# Altium project 扩展.PrjPCB (part 1 of 2)
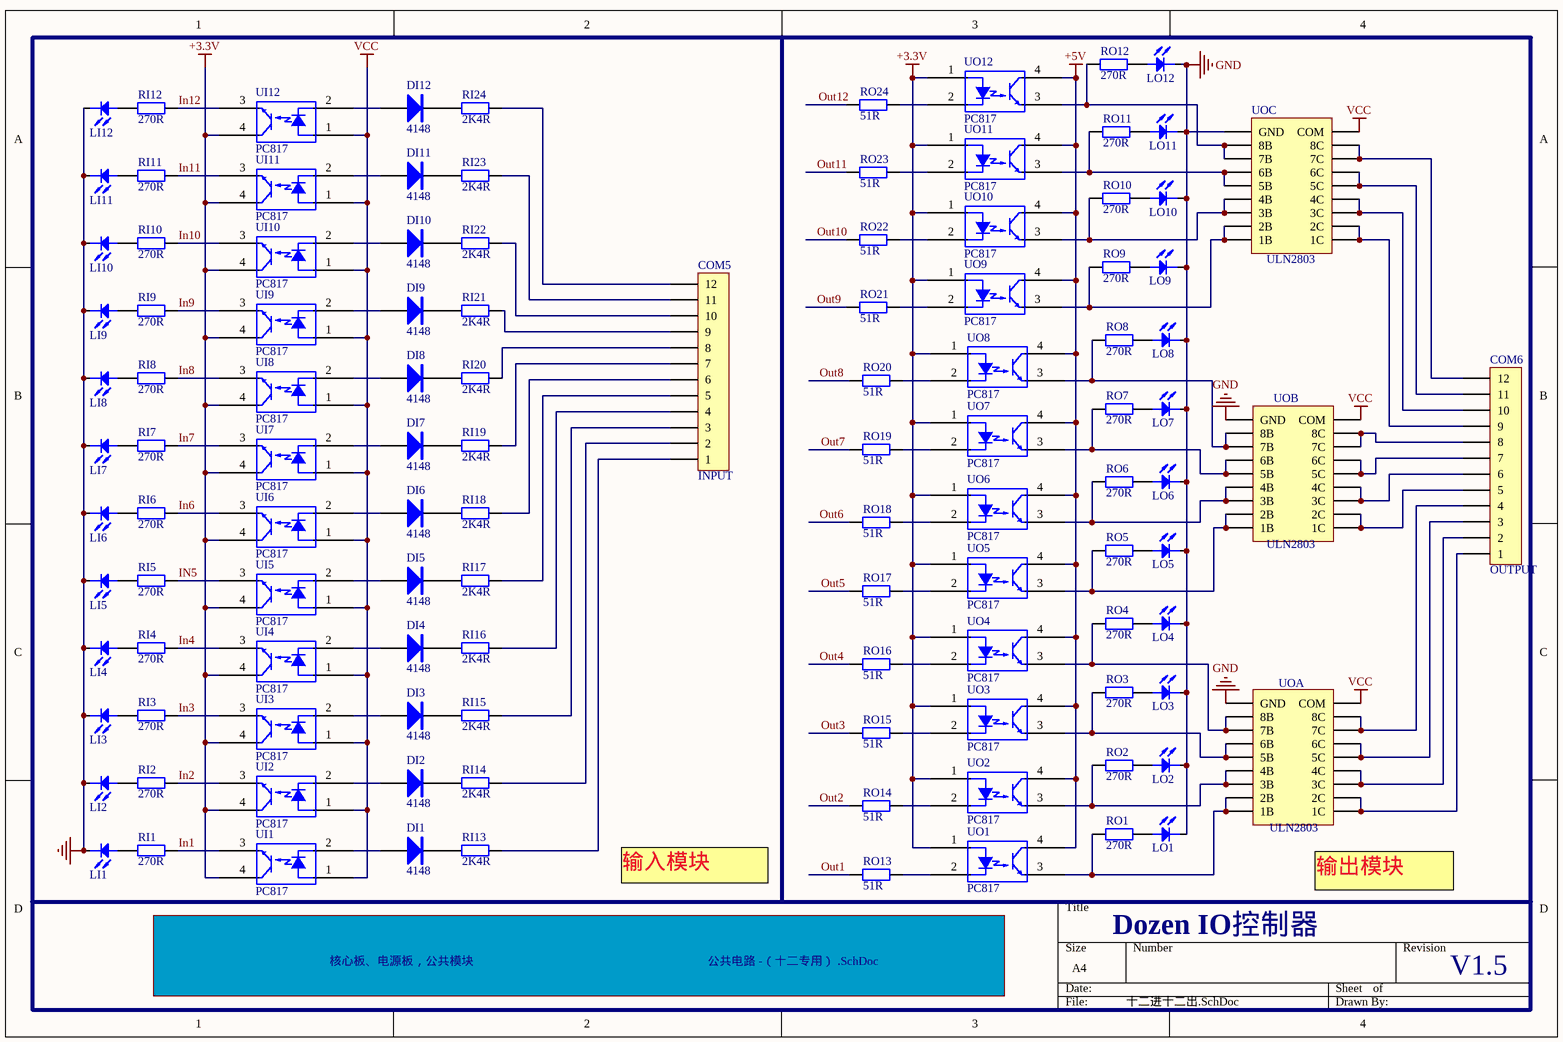
[diagram p0: 十二进十二出.SchDoc]
12 sheets, 1246 parts. Net scope: global (net labels, ports and power ports of the same name join across sheets).
Board files: 十二进十二出 .PcbDoc, 核心板.PcbDoc, 电源板.PcbDoc, 八进八出.PcbDoc, 十六路输入.PcbDoc, 十六路输出.PcbDoc, 十六继电器.PcbDoc, 电机控制.PcbDoc, 模拟量.PcbDoc, 四进四出三电机.PcbDoc, PCB模版.PcbDoc, 底板模版.PcbDoc
Sheets:
  十二进十二出.SchDoc
    核心板、电源板，公共模块 = 公共电路 -（十二专用） .SchDoc
  核心板.SchDoc
  电源板.SchDoc
  八进八出.SchDoc
    核心板、电源板 = 公共电路.SchDoc
  十六路输入.SchDoc
    MCU及电源 = 公共电路.SchDoc
  十六路输出.SchDoc
    MCU及电源 = 公共电路.SchDoc
  十六继电器.SchDoc
    MCU及电源 = 公共电路.SchDoc
  电机控制.SchDoc
     = 公共电路.SchDoc
  模拟量.SchDoc
    MCU及电源 = 公共电路.SchDoc
  四进四出三电机.SchDoc
    MCU及电源 = 公共电路.SchDoc

## Sheet 十二进十二出.SchDoc: Dozen IO控制器
size A4; Revision: V1.5; SheetNumber: 0; SheetTotal: 0; DrawnBy: 小熊

### Parts
COM5  INPUT  [CON12-5.1卧上]
COM6  OUTPUT  [CON12-5.1卧下]
DI1  4148  [1206C]
DI2  4148  [1206C]
DI3  4148  [1206C]
DI4  4148  [1206C]
DI5  4148  [1206C]
DI6  4148  [1206C]
DI7  4148  [1206C]
DI8  4148  [1206C]
DI9  4148  [1206C]
DI10  4148  [1206C]
DI11  4148  [1206C]
DI12  4148  [1206C]
LI1  LED  [SMDLED]  (value not drawn)
LI2  LED  [SMDLED]  (value not drawn)
LI3  LED  [SMDLED]  (value not drawn)
LI4  LED  [SMDLED]  (value not drawn)
LI5  LED  [SMDLED]  (value not drawn)
LI6  LED  [SMDLED]  (value not drawn)
LI7  LED  [SMDLED]  (value not drawn)
LI8  LED  [SMDLED]  (value not drawn)
LI9  LED  [SMDLED]  (value not drawn)
LI10  LED  [SMDLED]  (value not drawn)
LI11  LED  [SMDLED]  (value not drawn)
LI12  LED  [SMDLED]  (value not drawn)
LO1  LED  [SMDLED]  (value not drawn)
LO2  LED  [SMDLED]  (value not drawn)
LO3  LED  [SMDLED]  (value not drawn)
LO4  LED  [SMDLED]  (value not drawn)
LO5  LED  [SMDLED]  (value not drawn)
LO6  LED  [SMDLED]  (value not drawn)
LO7  LED  [SMDLED]  (value not drawn)
LO8  LED  [SMDLED]  (value not drawn)
LO9  LED  [SMDLED]  (value not drawn)
LO10  LED  [SMDLED]  (value not drawn)
LO11  LED  [SMDLED]  (value not drawn)
LO12  LED  [SMDLED]  (value not drawn)
RI1  270R  [0603A]
RI2  270R  [0603A]
RI3  270R  [0603A]
RI4  270R  [0603A]
RI5  270R  [0603A]
RI6  270R  [0603A]
RI7  270R  [0603A]
RI8  270R  [0603A]
RI9  270R  [0603A]
RI10  270R  [0603A]
RI11  270R  [0603A]
RI12  270R  [0603A]
RI13  2K4R  [0603A]
RI14  2K4R  [0603A]
RI15  2K4R  [0603A]
RI16  2K4R  [0603A]
RI17  2K4R  [0603A]
RI18  2K4R  [0603A]
RI19  2K4R  [0603A]
RI20  2K4R  [0603A]
RI21  2K4R  [0603A]
RI22  2K4R  [0603A]
RI23  2K4R  [0603A]
RI24  2K4R  [0603A]
RO1  270R  [0603A]
RO2  270R  [0603A]
RO3  270R  [0603A]
RO4  270R  [0603A]
RO5  270R  [0603A]
RO6  270R  [0603A]
RO7  270R  [0603A]
RO8  270R  [0603A]
RO9  270R  [0603A]
RO10  270R  [0603A]
RO11  270R  [0603A]
RO12  270R  [0603A]
RO13  51R  [0603A]
RO14  51R  [0603A]
RO15  51R  [0603A]
RO16  51R  [0603A]
RO17  51R  [0603A]
RO18  51R  [0603A]
RO19  51R  [0603A]
RO20  51R  [0603A]
RO21  51R  [0603A]
RO22  51R  [0603A]
RO23  51R  [0603A]
RO24  51R  [0603A]
UI1  PC817  [PC817]
UI2  PC817  [PC817]
UI3  PC817  [PC817]
UI4  PC817  [PC817]
UI5  PC817  [PC817]
UI6  PC817  [PC817]
UI7  PC817  [PC817]
UI8  PC817  [PC817]
UI9  PC817  [PC817]
UI10  PC817  [PC817]
UI11  PC817  [PC817]
UI12  PC817  [PC817]
UO1  PC817  [PC817]
UO2  PC817  [PC817]
UO3  PC817  [PC817]
UO4  PC817  [PC817]
UO5  PC817  [PC817]
UO6  PC817  [PC817]
UO7  PC817  [PC817]
UO8  PC817  [PC817]
UO9  PC817  [PC817]
UO10  PC817  [PC817]
UO11  PC817  [PC817]
UO12  PC817  [PC817]
UOA  ULN2803  [sol18]
UOB  ULN2803  [sol18]
UOC  ULN2803  [sol18]

### Sub-sheets
核心板、电源板，公共模块 = 公共电路 -（十二专用） .SchDoc: no entries

### Nets
+3.3V: UI1.4(COL) UI2.4(COL) UI3.4(COL) UI4.4(COL) UI5.4(COL) UI6.4(COL) UI7.4(COL) UI8.4(COL) UI9.4(COL) UI10.4(COL) UI11.4(COL) UI12.4(COL) UO1.1(ANODE) UO2.1(ANODE) UO3.1(ANODE) UO4.1(ANODE) UO5.1(ANODE) UO6.1(ANODE) UO7.1(ANODE) UO8.1(ANODE) UO9.1(ANODE) UO10.1(ANODE) UO11.1(ANODE) UO12.1(ANODE)
+5V: UO1.4(COL) UO2.4(COL) UO3.4(COL) UO4.4(COL) UO5.4(COL) UO6.4(COL) UO7.4(COL) UO8.4(COL) UO9.4(COL) UO10.4(COL) UO11.4(COL) UO12.4(COL)
GND: LI1.K LI2.K LI3.K LI4.K LI5.K LI6.K LI7.K LI8.K LI9.K LI10.K LI11.K LI12.K LO1.K LO2.K LO3.K LO4.K LO5.K LO6.K LO7.K LO8.K LO9.K LO10.K LO11.K LO12.K UOA.9(GND) UOB.9(GND) UOC.9(GND)
VCC: UI1.1(ANODE) UI2.1(ANODE) UI3.1(ANODE) UI4.1(ANODE) UI5.1(ANODE) UI6.1(ANODE) UI7.1(ANODE) UI8.1(ANODE) UI9.1(ANODE) UI10.1(ANODE) UI11.1(ANODE) UI12.1(ANODE) UOA.10(COM) UOB.10(COM) UOC.10(COM)
In1: RI1.1 UI1.3(EMIT)
In2: RI2.1 UI2.3(EMIT)
In3: RI3.1 UI3.3(EMIT)
In4: RI4.1 UI4.3(EMIT)
IN5: RI5.1 UI5.3(EMIT)
In6: RI6.1 UI6.3(EMIT)
In7: RI7.1 UI7.3(EMIT)
In8: RI8.1 UI8.3(EMIT)
In9: RI9.1 UI9.3(EMIT)
In10: RI10.1 UI10.3(EMIT)
In11: RI11.1 UI11.3(EMIT)
In12: RI12.1 UI12.3(EMIT)
Out1: RO13.1
Out2: RO14.1
Out3: RO15.1
Out4: RO16.1
Out5: RO17.1
Out6: RO18.1
Out7: RO19.1
Out8: RO20.1
Out9: RO21.1
Out10: RO22.1
Out11: RO23.1
Out12: RO24.1
NetCOM5_1: COM5.1 RI13.2
NetCOM5_2: COM5.2 RI14.2
NetCOM5_3: COM5.3 RI15.2
NetCOM5_4: COM5.4 RI16.2
NetCOM5_5: COM5.5 RI17.2
NetCOM5_6: COM5.6 RI18.2
NetCOM5_7: COM5.7 RI19.2
NetCOM5_8: COM5.8 RI20.2
NetCOM5_9: COM5.9 RI21.2
NetCOM5_10: COM5.10 RI22.2
NetCOM5_11: COM5.11 RI23.2
NetCOM5_12: COM5.12 RI24.2
NetCOM6_1: COM6.1 UOA.17(2C) UOA.18(1C)
NetCOM6_2: COM6.2 UOA.15(4C) UOA.16(3C)
NetCOM6_3: COM6.3 UOA.13(6C) UOA.14(5C)
NetCOM6_4: COM6.4 UOA.11(8C) UOA.12(7C)
NetCOM6_5: COM6.5 UOB.17(2C) UOB.18(1C)
NetCOM6_6: COM6.6 UOB.15(4C) UOB.16(3C)
NetCOM6_7: COM6.7 UOB.13(6C) UOB.14(5C)
NetCOM6_8: COM6.8 UOB.11(8C) UOB.12(7C)
NetCOM6_9: COM6.9 UOC.17(2C) UOC.18(1C)
NetCOM6_10: COM6.10 UOC.15(4C) UOC.16(3C)
NetCOM6_11: COM6.11 UOC.13(6C) UOC.14(5C)
NetCOM6_12: COM6.12 UOC.11(8C) UOC.12(7C)
NetDI1_A: DI1.A UI1.2(CATH)
NetDI1_K: DI1.K RI13.1
NetDI2_A: DI2.A UI2.2(CATH)
NetDI2_K: DI2.K RI14.1
NetDI3_A: DI3.A UI3.2(CATH)
NetDI3_K: DI3.K RI15.1
NetDI4_A: DI4.A UI4.2(CATH)
NetDI4_K: DI4.K RI16.1
NetDI5_A: DI5.A UI5.2(CATH)
NetDI5_K: DI5.K RI17.1
NetDI6_A: DI6.A UI6.2(CATH)
NetDI6_K: DI6.K RI18.1
NetDI7_A: DI7.A UI7.2(CATH)
NetDI7_K: DI7.K RI19.1
NetDI8_A: DI8.A UI8.2(CATH)
NetDI8_K: DI8.K RI20.1
NetDI9_A: DI9.A UI9.2(CATH)
NetDI9_K: DI9.K RI21.1
NetDI10_A: DI10.A UI10.2(CATH)
NetDI10_K: DI10.K RI22.1
NetDI11_A: DI11.A UI11.2(CATH)
NetDI11_K: DI11.K RI23.1
NetDI12_A: DI12.A UI12.2(CATH)
NetDI12_K: DI12.K RI24.1
NetLI1_A: LI1.A RI1.2
NetLI2_A: LI2.A RI2.2
NetLI3_A: LI3.A RI3.2
NetLI4_A: LI4.A RI4.2
NetLI5_A: LI5.A RI5.2
NetLI6_A: LI6.A RI6.2
NetLI7_A: LI7.A RI7.2
NetLI8_A: LI8.A RI8.2
NetLI9_A: LI9.A RI9.2
NetLI10_A: LI10.A RI10.2
NetLI11_A: LI11.A RI11.2
NetLI12_A: LI12.A RI12.2
NetLO1_A: LO1.A RO1.2
NetLO2_A: LO2.A RO2.2
NetLO3_A: LO3.A RO3.2
NetLO4_A: LO4.A RO4.2
NetLO5_A: LO5.A RO5.2
NetLO6_A: LO6.A RO6.2
NetLO7_A: LO7.A RO7.2
NetLO8_A: LO8.A RO8.2
NetLO9_A: LO9.A RO9.2
NetLO10_A: LO10.A RO10.2
NetLO11_A: LO11.A RO11.2
NetLO12_A: LO12.A RO12.2
NetRO1_1: RO1.1 UO1.3(EMIT) UOA.1(1B) UOA.2(2B)
NetRO2_1: RO2.1 UO2.3(EMIT) UOA.3(3B) UOA.4(4B)
NetRO3_1: RO3.1 UO3.3(EMIT) UOA.5(5B) UOA.6(6B)
NetRO4_1: RO4.1 UO4.3(EMIT) UOA.7(7B) UOA.8(8B)
NetRO5_1: RO5.1 UO5.3(EMIT) UOB.1(1B) UOB.2(2B)
NetRO6_1: RO6.1 UO6.3(EMIT) UOB.3(3B) UOB.4(4B)
NetRO7_1: RO7.1 UO7.3(EMIT) UOB.5(5B) UOB.6(6B)
NetRO8_1: RO8.1 UO8.3(EMIT) UOB.7(7B) UOB.8(8B)
NetRO9_1: RO9.1 UO9.3(EMIT) UOC.1(1B) UOC.2(2B)
NetRO10_1: RO10.1 UO10.3(EMIT) UOC.3(3B) UOC.4(4B)
NetRO11_1: RO11.1 UO11.3(EMIT) UOC.5(5B) UOC.6(6B)
NetRO12_1: RO12.1 UO12.3(EMIT) UOC.7(7B) UOC.8(8B)
NetRO13_2: RO13.2 UO1.2(CATH)
NetRO14_2: RO14.2 UO2.2(CATH)
NetRO15_2: RO15.2 UO3.2(CATH)
NetRO16_2: RO16.2 UO4.2(CATH)
NetRO17_2: RO17.2 UO5.2(CATH)
NetRO18_2: RO18.2 UO6.2(CATH)
NetRO19_2: RO19.2 UO7.2(CATH)
NetRO20_2: RO20.2 UO8.2(CATH)
NetRO21_2: RO21.2 UO9.2(CATH)
NetRO22_2: RO22.2 UO10.2(CATH)
NetRO23_2: RO23.2 UO11.2(CATH)
NetRO24_2: RO24.2 UO12.2(CATH)

### Notes on the sheet
- 输入模块
- (near UOA) 输出模块

### Library data of the parts
COM5 COM6 = CON12
RI1-RI24 RO1-RO24 = Res2: Resistor; Value: 1K; Published: 8-Jun-2000; LatestRevisionDate: 17-Jul-2002; LatestRevisionNote: Re-released for DXP Platform.; PackageReference: AXIAL-0.4; Publisher: Altium Limited
UI1-UI12 UO1-UO12 = TLP521-1: Single NPN PhotoTransistor OptoCoupler.

## Sheet 公共电路 -（十二专用） .SchDoc: Dozen IO控制器
size A4; Revision: V1.5; Time: 2014年3月27日11:29:06
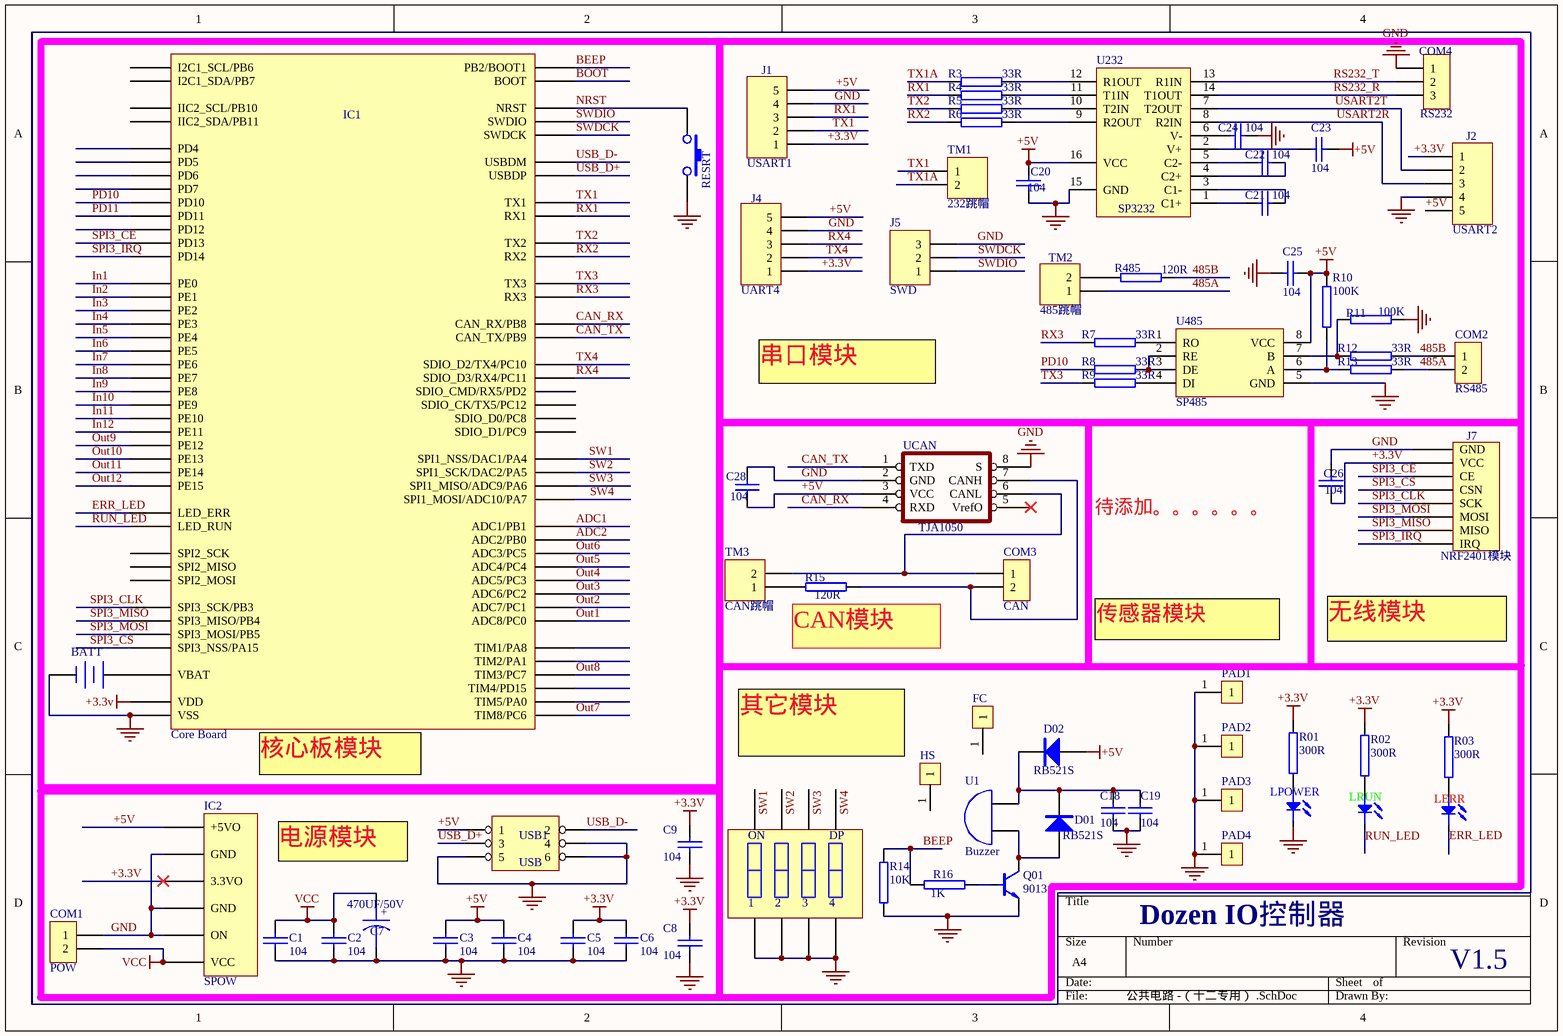
[diagram p1: 公共电路 -（十二专用） .SchDoc]

### Parts
(Parts that share a designator on the sheet are numbered #1, #2 ... from top to bottom, then left to right.)
BATT  电源底座  [MINI-BAT]  (value not drawn)
C1#1  104  [0603A]
C2#1  104  [0603A]
C3#1  104  [0603A]
C4#1  104  [0603A]
C5#1  104  [0603A]
C6#1  104  [0603A]
C7#1  470UF/50V  [电解电容10mm]
C8#1  104  [0603A]
C9  104  [0603A]
C18#1  104  [0603A]
C19  104  [0603A]
C20  104  [0603A]
C21  104  [0603A]
C22  104  [0603A]
C23  104  [0603A]
C24  104  [0603A]
C25  104  [0603A]
C26#1  104  [0603A]
C28  104  [0603A]
COM1  POW  [CON2-5.1卧]
COM2  RS485  [CON2-5.1卧]
COM3  CAN  [CON2-5.1卧]
COM4#1  RS232  [CON3-5.1卧]
D01  RB521S  [贴片二极管]
D02  RB521S  [贴片二极管]
FC  (no value)  [fc]
HS  (no value)  [HS]
IC1  Core Board  [核心板-物联网1]
IC2  SPOW  [电源板]
J1#1  USART1  [2.54排针1*5]
J2#1  USART2  [2.54排针1*5]
J4  UART4  [2.54排针1*5]
J5  SWD  [2.54排针1*3]
J7  NRF2401模块  [NRF24L01]
LERR  ERR  [LED2.5]  (value not drawn)
LPOWER  PLED  [LED2.5]  (value not drawn)
LRUN  RUN  [LED2.5]  (value not drawn)
PAD1  PAD  [PAD]  (value not drawn)
PAD2  PAD  [PAD]  (value not drawn)
PAD3  PAD  [PAD]  (value not drawn)
PAD4  PAD  [PAD]  (value not drawn)
Q01  9013  [SOT23]
R01  300R  [0603A]
R02  300R  [0603A]
R03  300R  [0603A]
R3  33R  [0603A]
R4  33R  [0603A]
R5  33R  [0603A]
R6  33R  [0603A]
R7  33R  [0603A]
R8  33R  [0603A]
R9  33R  [0603A]
R10  100K  [0603A]
R11  100K  [0603A]
R12  33R  [0603A]
R13  33R  [0603A]
R14#1  10K  [0603A]
R15#1  120R  [0603A]
R16#1  1K  [0603A]
R485  120R  [0603A]
S1  拨码开关*4  [SWITCH*4]  (value not drawn)
S2  RESRT  [SW-PB2]
TM1  232跳帽  [2.54排针1*2]
TM2  485跳帽  [2.54排针1*2]
TM3  CAN跳帽  [2.54排针1*2]
U1#1  Buzzer  [蜂鸣器]
U232  SP3232  [TSSOP16]
U485  SP485  [SO8_L]
UCAN  TJA1050  [SO8_L]
USB1  USB  [USB-B3]

### Nets
+3.3V: C5#1.1 C6#1.1 C8#1.1 C9.1 C26#1.2 IC1.2(VDD) IC2.3(3.3VO) J1#1.1 J2#1.1 J4.1 J7.2(VCC) R01.1 R02.1 R03.1
+5V: C3#1.1 C4#1.1 C20.1 C23.2 C25.2 C28.2 D02.A IC2.1(+5VO) J1#1.5 J2#1.5 J4.5 R10.2 U232.16(VCC) U485.8(VCC) UCAN.3(VCC) USB1.1
GND: BATT.2(-) C1#1.2 C2#1.2 C3#1.2 C4#1.2 C5#1.2 C6#1.2 C7#1.2 C8#1.2 C9.2 C18#1.2 C19.2 C20.2 C24.2 C25.1 C26#1.1 C28.1 COM1.1 COM4#1.1 IC1.1(VSS) IC2.2(GND) IC2.4(GND) IC2.5(ON) J1#1.4 J2#1.4 J4.4 J5.3 J7.1(GND) LPOWER.K PAD1.1 PAD2.1 PAD3.1 PAD4.1 Q01.2(e) R11.2 R14#1.1 S1.5 S1.6 S1.7 S1.8 S2.2 U232.15(GND) U485.5(GND) UCAN.2(GND) UCAN.8(S) USB1.4 USB1.5 USB1.6
VCC: C1#1.1 C2#1.1 C7#1.1 COM1.2 IC2.6(VCC)
485A: COM2.2 R13.2 TM2.1
485B: COM2.1 R12.2 R485.2
ADC1: IC1.33(ADC1/PB1)
ADC2: IC1.34(ADC2/PB0)
BEEP: IC1.31(PB2/BOOT1) R14#1.2 R16#1.1
BOOT: IC1.3(BOOT)
CAN_RX: IC1.68(CAN_RX/PB8) UCAN.4(RXD)
CAN_TX: IC1.67(CAN_TX/PB9) UCAN.1(TXD)
ERR_LED: IC1.11(LED_ERR) LERR.K
In1: IC1.58(PE0)
In2: IC1.57(PE1)
In3: IC1.56(PE2)
In4: IC1.55(PE3)
IN5: IC1.54(PE4)
In6: IC1.53(PE5)
In7: IC1.52(PE6)
In8: IC1.51(PE7)
In9: IC1.30(PE8)
In10: IC1.29(PE9)
In11: IC1.28(PE10)
In12: IC1.27(PE11)
NRST: IC1.4(NRST) S2.1
Out1: IC1.49(ADC8/PC0)
Out2: IC1.50(ADC7/PC1)
Out3: IC1.47(ADC6/PC2)
Out4: IC1.48(ADC5/PC3)
Out5: IC1.36(ADC4/PC4)
Out6: IC1.35(ADC3/PC5)
Out7: IC1.41(TIM8/PC6)
Out8: IC1.44(TIM3/PC7)
Out9: IC1.26(PE12)
Out10: IC1.25(PE13)
Out11: IC1.24(PE14)
Out12: IC1.23(PE15)
PD10: IC1.13(PD10) R8.1
PD11: IC1.62(PD11)
RS232_R: COM4#1.3 U232.14(T1OUT)
RS232_T: COM4#1.2 U232.13(R1IN)
RUN_LED: IC1.12(LED_RUN) LRUN.K
RX1: IC1.10(RX1) J1#1.3 R4.1
RX2: IC1.18(RX2) R6.1
RX3: IC1.20(RX3) R7.1
RX4: IC1.80(SDIO_D3/RX4/PC11) J4.3
SPI3_CE: IC1.60(PD13) J7.3(CE)
SPI3_CLK: IC1.73(SPI3_SCK/PB3) J7.5(SCK)
SPI3_CS: IC1.74(SPI3_NSS/PA15) J7.4(CSN)
SPI3_IRQ: IC1.59(PD14) J7.8(IRQ)
SPI3_MISO: IC1.72(SPI3_MISO/PB4) J7.7(MISO)
SPI3_MOSI: IC1.71(SPI3_MOSI/PB5) J7.6(MOSI)
SW1: IC1.39(SPI1_NSS/DAC1/PA4) S1.1
SW2: IC1.40(SPI1_SCK/DAC2/PA5) S1.2
SW3: IC1.37(SPI1_MISO/ADC9/PA6) S1.3
SW4: IC1.38(SPI1_MOSI/ADC10/PA7) S1.4
SWDCK: IC1.6(SWDCK) J5.2
SWDIO: IC1.5(SWDIO) J5.1
TX1: IC1.9(TX1) J1#1.2 TM1.1
TX1A: R3.1 TM1.2
TX2: IC1.17(TX2) R5.1
TX3: IC1.19(TX3) R9.1
TX4: IC1.79(SDIO_D2/TX4/PC10) J4.2
USART2R: J2#1.3 U232.8(R2IN)
USART2T: J2#1.2 U232.7(T2OUT)
USB_D+: IC1.8(USBDP) USB1.3
USB_D-: IC1.7(USBDM) USB1.2
NetBATT_1: BATT.1(+) IC1.32(VBAT)
NetC18#1_1: C18#1.1 C19.1 D01.K D02.K U1#1.1(A)
NetC21_1: C21.1 U232.1(C1+)
NetC21_2: C21.2 U232.3(C1-)
NetC22_1: C22.1 U232.5(C2-)
NetC22_2: C22.2 U232.4(C2+)
NetC23_1: C23.1 U232.2(V+)
NetC24_1: C24.1 U232.6(V-)
NetCOM3_1: COM3.1 TM3.2 UCAN.6(CANL)
NetCOM3_2: COM3.2 R15#1.2 UCAN.7(CANH)
NetD01_A: D01.A Q01.3(c) U1#1.2(B)
NetLERR_A: LERR.A R03.2
NetLPOWER_A: LPOWER.A R01.2
NetLRUN_A: LRUN.A R02.2
NetQ01_1: Q01.1(b) R16#1.2
NetR3_2: R3.2 U232.12(R1OUT)
NetR4_2: R4.2 U232.11(T1IN)
NetR5_2: R5.2 U232.10(T2IN)
NetR6_2: R6.2 U232.9(R2OUT)
NetR7_2: R7.2 U485.1(RO)
NetR8_2: R8.2 U485.2(RE) U485.3(DE)
NetR9_2: R9.2 U485.4(DI)
NetR10_1: R10.1 R13.1 U485.6(A)
NetR11_1: R11.1 R12.1 U485.7(B)
NetR15#1_1: R15#1.1 TM3.1
NetR485_1: R485.1 TM2.2

Not connected (* = marked no-connect by the designer): FC 1; HS 1; IC1 14(SPI2_SCK) 15(SPI2_MISO) 16(SPI2_MOSI) 21(IIC2_SDA/PB11) 22(IIC2_SCL/PB10) 42(TIM4/PD15) 43(TIM1/PA8) 45(TIM5/PA0) 46(TIM2/PA1) 61(PD12) 63(PD4) 64(PD5) 65(PD6) 66(PD7) 69(I2C1_SDA/PB7) 70(I2C1_SCL/PB6) 75(SDIO_D1/PC9) 76(SDIO_D0/PC8) 77(SDIO_CMD/RX5/PD2) 78(SDIO_CK/TX5/PC12); UCAN 5(VrefO)*

### Notes on the sheet
- 串口模块
- (near C26#1) 待添加。。。。。。
- (near R15#1) CAN模块
- (near PAD1) 传感器模块
- (near J7) 无线模块
- (near IC1) 核心板模块
- (near HS) 其它模块
- 电源模块
- (in symbol CAPACITOR POL) +
- (in symbol 拨码开关*4) ON; DP

### Library data of the parts
BATT = Battery: XH414H; Published: 24-Mar-1999; LatestRevisionDate: 17-Jul-2002; LatestRevisionNote: Re-released for DXP Platform.; PackageReference: BAT-2; Publisher: Altium Limited; PackageDescription: Battery; 2 Leads
C1#1 C2#1 C3#1 C4#1 C5#1 C6#1 C8#1 C9 C18#1 C19-C25 C26#1 C28 = CAP: Capacitor
C7#1 = CAPACITOR POL: Capacitor
COM1-COM3 = CON2
COM4#1 = CON3
FC HS = PAD
IC1 = 物联网核心板
J1#1 J2#1 J4 = Header 5: Header, 4-Pin; LatestRevisionDate: 17-Jul-2002; LatestRevisionNote: Re-released for DXP Platform.; Publisher: Altium Limited
J5 = Header 3: Header, 4-Pin; LatestRevisionDate: 17-Jul-2002; LatestRevisionNote: Re-released for DXP Platform.; Publisher: Altium Limited
LERR LPOWER LRUN = LED
Q01 = NPN
R01 R02 R03 R3-R13 R14#1 R15#1 R16#1 R485 = RES2
S2 = SW-PB
TM1-TM3 = Header 2: Header, 2-Pin; LatestRevisionDate: 17-Jul-2002; LatestRevisionNote: Re-released for DXP Platform.; Publisher: Altium Limited
U232 = SP3232EEA
USB1 = HEADER 3X2

## Sheet 核心板.SchDoc: 阿波罗简易型控制器核心板
size A3; CompanyName: 东莞市月无声电子设备有限公司; Revision: V1.2; DocumentName: 阿波罗简易型控制器核心板
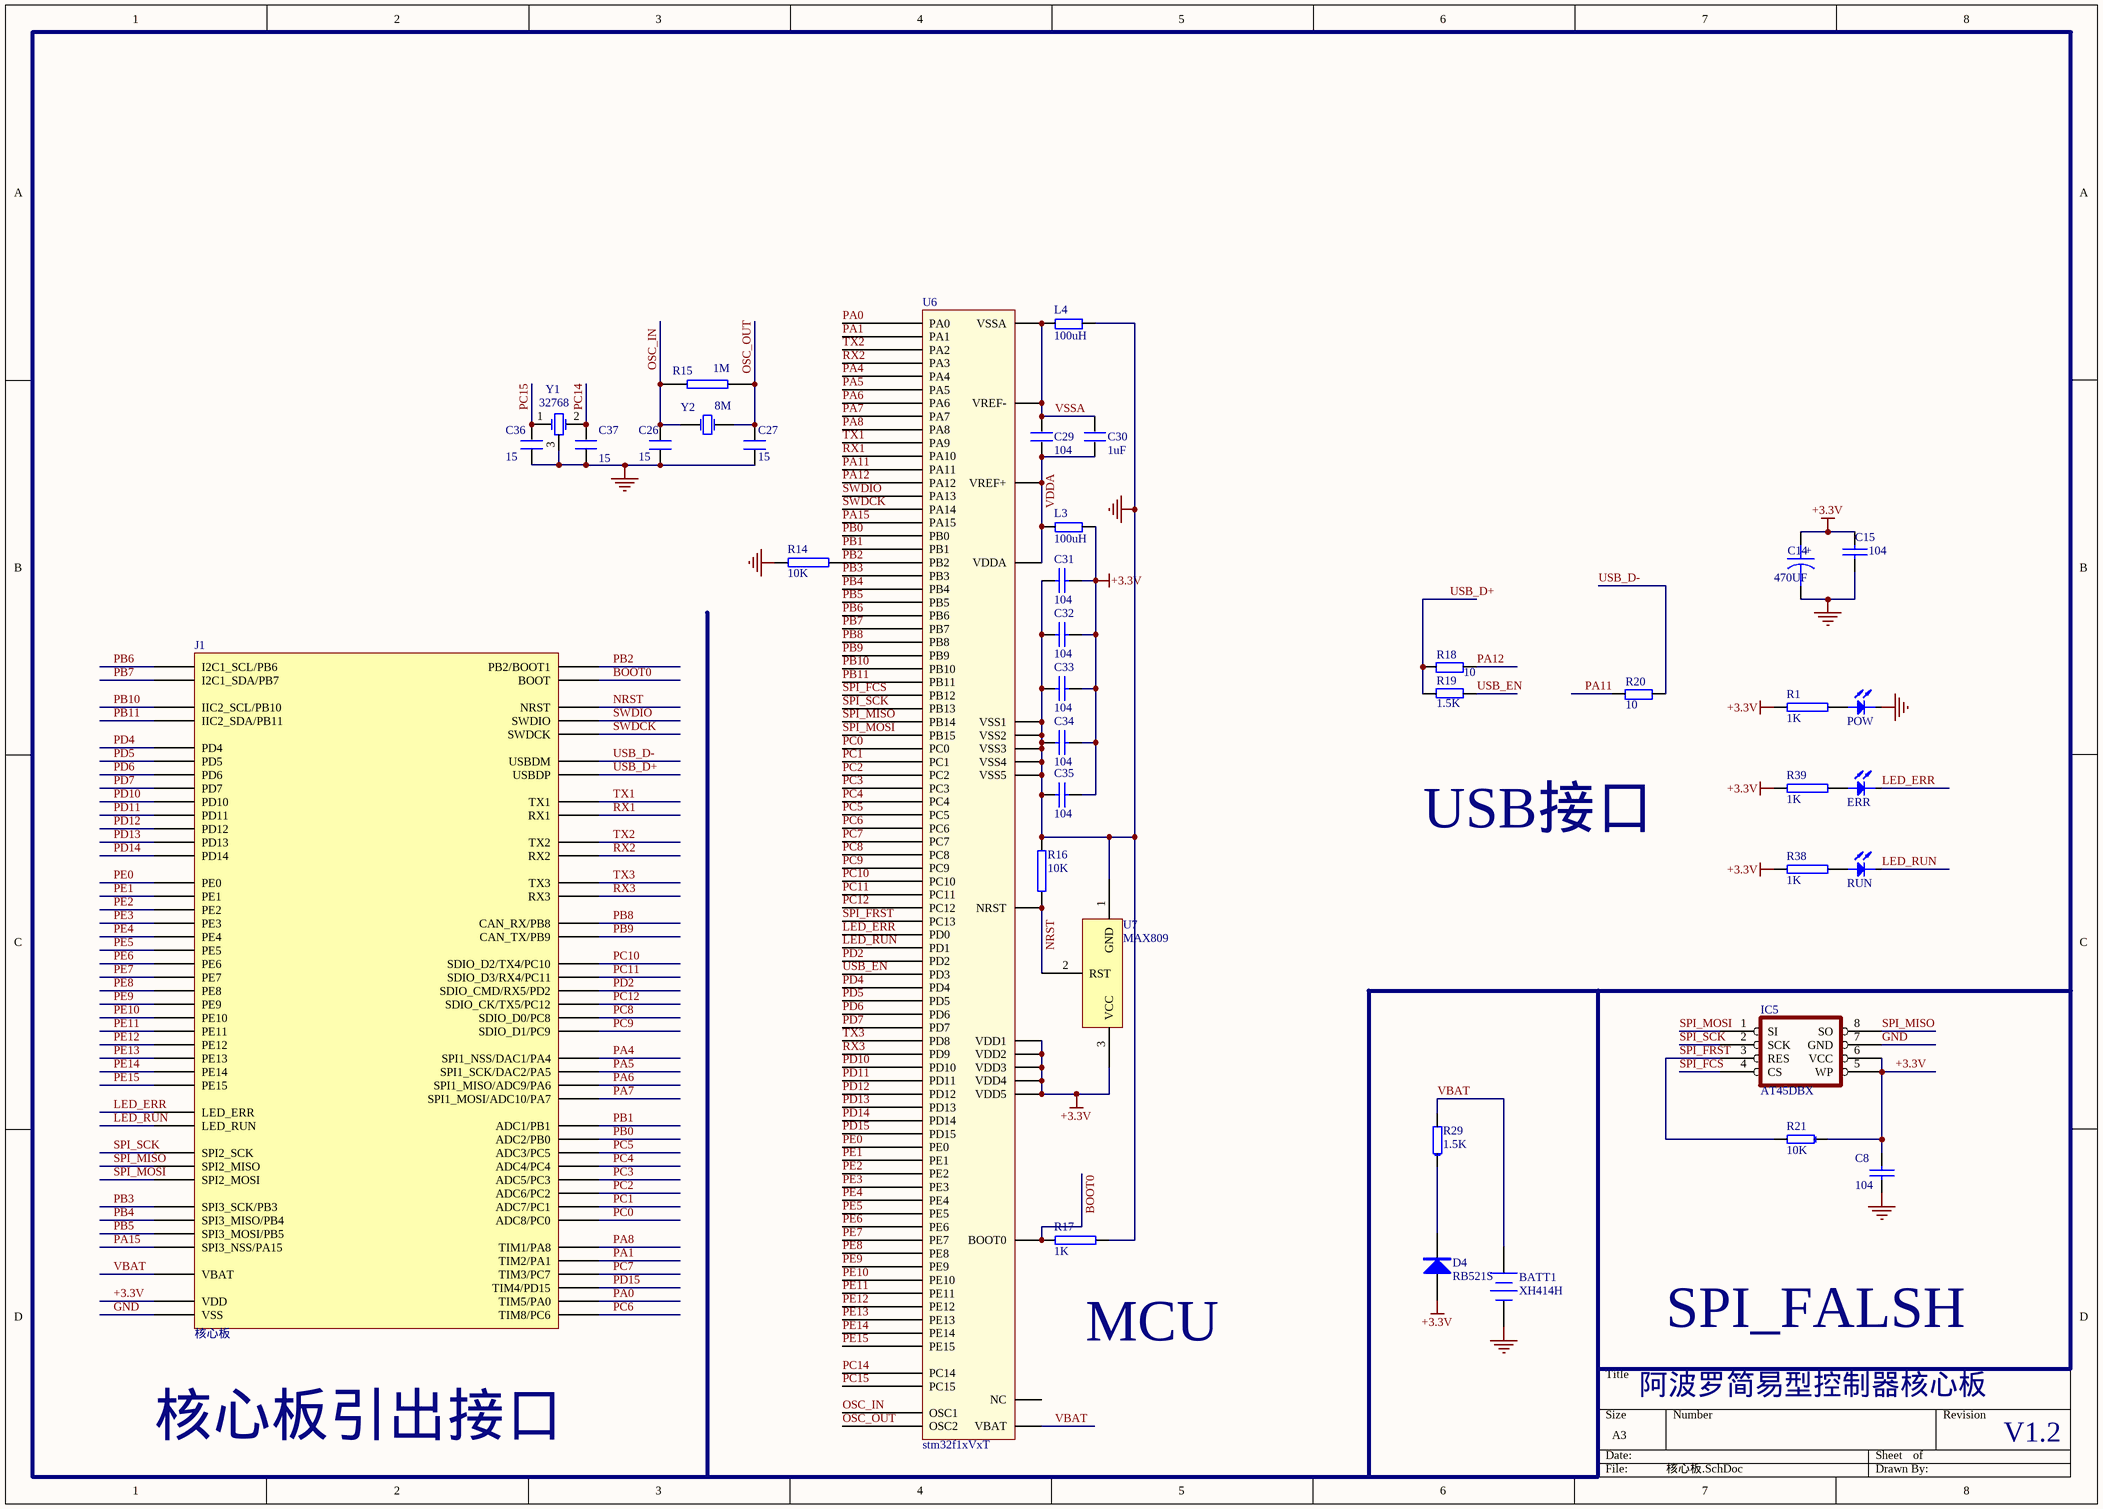
[diagram p2: 核心板.SchDoc]

### Parts
(Parts that share a designator on the sheet are numbered #1, #2 ... from top to bottom, then left to right.)
BATT1  XH414H  [XH414H_IV01E]
C8#2  104  [0603A]
C14#1  470UF  [1206C]
C15#1  104  [0603A]
C26#2  15  [0603A]
C27#1  15  [0603A]
C29#1  104  [0603A]
C30  1uF  [0805]
C31  104  [0603A]
C32  104  [0603A]
C33  104  [0603A]
C34  104  [0603A]
C35  104  [0603A]
C36  15  [0603A]
C37  15  [0603A]
D4  RB521S  [0603D]
ERR  (no value)  [SMDLED]
IC5  AT45DBX  [SOIC-8]
J1#2  核心板  [核心板-物联网1]
L3  100uH  [0805]
L4  100uH  [0805]
POW  (no value)  [SMDLED]
R1#1  1K  [0603A]
R14#2  10K  [0603A]
R15#2  1M  [0603A]
R16#2  10K  [0603A]
R17  1K  [0603A]
R18  10  [0603A]
R19  1.5K  [0603A]
R20  10  [0603A]
R21#1  10K  [0603A]
R29  1.5K  [0603A]
R38#1  1K  [0603A]
R39#1  1K  [0603A]
RUN  (no value)  [SMDLED]
U6  stm32f1xVxT
U7  MAX809  [SOT23]
Y1  32768  [MC-146]
Y2  8M  [XTAL-5032]

### Nets
+3.3V: C8#2.1 C14#1.1 C15#1.1 C31.1 C32.1 C33.1 C34.1 C35.1 D4.A IC5.5(WP) IC5.6(VCC) J1#2.2(VDD) L3.2 R1#1.1 R21#1.1 R38#1.1 R39#1.1 U6.11(VDD5) U6.28(VDD4) U6.50(VDD1) U6.75(VDD2) U6.100(VDD3) U7.3(VCC)
GND: BATT1.2(-) C8#2.2 C14#1.2 C15#1.2 C26#2.2 C27#1.2 C31.2 C32.2 C33.2 C34.2 C35.2 C36.1 C37.1 IC5.7(GND) J1#2.1(VSS) L4.2 POW.K R14#2.1 R16#2.2 R17.1 U6.10(VSS5) U6.27(VSS4) U6.49(VSS1) U6.74(VSS2) U6.99(VSS3) U7.1(GND) Y1.3
BOOT0: J1#2.3(BOOT) R17.2 U6.94(BOOT0)
LED_ERR: ERR.K J1#2.11(LED_ERR) U6.81(PD0)
LED_RUN: J1#2.12(LED_RUN) RUN.K U6.82(PD1)
NRST: J1#2.4(NRST) R16#2.1 U6.14(NRST) U7.2(RST)
OSC_IN: C26#2.1 R15#2.1 U6.12(OSC1) Y2.2(OSC2)
OSC_OUT: C27#1.1 R15#2.2 U6.13(OSC2) Y2.1(OSC1)
PA0: J1#2.45(TIM5/PA0) U6.23(PA0)
PA1: J1#2.46(TIM2/PA1) U6.24(PA1)
PA4: J1#2.39(SPI1_NSS/DAC1/PA4) U6.29(PA4)
PA5: J1#2.40(SPI1_SCK/DAC2/PA5) U6.30(PA5)
PA6: J1#2.37(SPI1_MISO/ADC9/PA6) U6.31(PA6)
PA7: J1#2.38(SPI1_MOSI/ADC10/PA7) U6.32(PA7)
PA8: J1#2.43(TIM1/PA8) U6.67(PA8)
PA11: R20.1 U6.70(PA11)
PA12: R18.2 U6.71(PA12)
PA15: J1#2.74(SPI3_NSS/PA15) U6.77(PA15)
PB0: J1#2.34(ADC2/PB0) U6.35(PB0)
PB1: J1#2.33(ADC1/PB1) U6.36(PB1)
PB2: J1#2.31(PB2/BOOT1) R14#2.2 U6.37(PB2)
PB3: J1#2.73(SPI3_SCK/PB3) U6.89(PB3)
PB4: J1#2.72(SPI3_MISO/PB4) U6.90(PB4)
PB5: J1#2.71(SPI3_MOSI/PB5) U6.91(PB5)
PB6: J1#2.70(I2C1_SCL/PB6) U6.92(PB6)
PB7: J1#2.69(I2C1_SDA/PB7) U6.93(PB7)
PB8: J1#2.68(CAN_RX/PB8) U6.95(PB8)
PB9: J1#2.67(CAN_TX/PB9) U6.96(PB9)
PB10: J1#2.22(IIC2_SCL/PB10) U6.47(PB10)
PB11: J1#2.21(IIC2_SDA/PB11) U6.48(PB11)
PC0: J1#2.49(ADC8/PC0) U6.15(PC0)
PC1: J1#2.50(ADC7/PC1) U6.16(PC1)
PC2: J1#2.47(ADC6/PC2) U6.17(PC2)
PC3: J1#2.48(ADC5/PC3) U6.18(PC3)
PC4: J1#2.36(ADC4/PC4) U6.33(PC4)
PC5: J1#2.35(ADC3/PC5) U6.34(PC5)
PC6: J1#2.41(TIM8/PC6) U6.63(PC6)
PC7: J1#2.44(TIM3/PC7) U6.64(PC7)
PC8: J1#2.76(SDIO_D0/PC8) U6.65(PC8)
PC9: J1#2.75(SDIO_D1/PC9) U6.66(PC9)
PC10: J1#2.79(SDIO_D2/TX4/PC10) U6.78(PC10)
PC11: J1#2.80(SDIO_D3/RX4/PC11) U6.79(PC11)
PC12: J1#2.78(SDIO_CK/TX5/PC12) U6.80(PC12)
PC14: C37.2 U6.8(PC14) Y1.2(OSC2)
PC15: C36.2 U6.9(PC15) Y1.1(OSC1)
PD2: J1#2.77(SDIO_CMD/RX5/PD2) U6.83(PD2)
PD4: J1#2.63(PD4) U6.85(PD4)
PD5: J1#2.64(PD5) U6.86(PD5)
PD6: J1#2.65(PD6) U6.87(PD6)
PD7: J1#2.66(PD7) U6.88(PD7)
PD10: J1#2.13(PD10) U6.57(PD10)
PD11: J1#2.62(PD11) U6.58(PD11)
PD12: J1#2.61(PD12) U6.59(PD12)
PD13: J1#2.60(PD13) U6.60(PD13)
PD14: J1#2.59(PD14) U6.61(PD14)
PD15: J1#2.42(TIM4/PD15) U6.62(PD15)
PE0: J1#2.58(PE0) U6.97(PE0)
PE1: J1#2.57(PE1) U6.98(PE1)
PE2: J1#2.56(PE2) U6.1(PE2)
PE3: J1#2.55(PE3) U6.2(PE3)
PE4: J1#2.54(PE4) U6.3(PE4)
PE5: J1#2.53(PE5) U6.4(PE5)
PE6: J1#2.52(PE6) U6.5(PE6)
PE7: J1#2.51(PE7) U6.38(PE7)
PE8: J1#2.30(PE8) U6.39(PE8)
PE9: J1#2.29(PE9) U6.40(PE9)
PE10: J1#2.28(PE10) U6.41(PE10)
PE11: J1#2.27(PE11) U6.42(PE11)
PE12: J1#2.26(PE12) U6.43(PE12)
PE13: J1#2.25(PE13) U6.44(PE13)
PE14: J1#2.24(PE14) U6.45(PE14)
PE15: J1#2.23(PE15) U6.46(PE15)
RX1: J1#2.10(RX1) U6.69(PA10)
RX2: J1#2.18(RX2) U6.26(PA3)
RX3: J1#2.20(RX3) U6.56(PD9)
SPI_FCS: IC5.4(CS) U6.51(PB12)
SPI_FRST: IC5.3(RES) R21#1.2 U6.7(PC13)
SPI_MISO: IC5.8(SO) J1#2.15(SPI2_MISO) U6.53(PB14)
SPI_MOSI: IC5.1(SI) J1#2.16(SPI2_MOSI) U6.54(PB15)
SPI_SCK: IC5.2(SCK) J1#2.14(SPI2_SCK) U6.52(PB13)
SWDCK: J1#2.6(SWDCK) U6.76(PA14)
SWDIO: J1#2.5(SWDIO) U6.72(PA13)
TX1: J1#2.9(TX1) U6.68(PA9)
TX2: J1#2.17(TX2) U6.25(PA2)
TX3: J1#2.19(TX3) U6.55(PD8)
USB_D+: J1#2.8(USBDP) R18.1 R19.2
USB_D-: J1#2.7(USBDM) R20.2
USB_EN: R19.1 U6.84(PD3)
VBAT: BATT1.1(+) J1#2.32(VBAT) R29.2 U6.6(VBAT)
VDDA: C29#1.2 C30.2 L3.1 U6.21(VREF+) U6.22(VDDA)
VSSA: C29#1.1 C30.1 L4.1 U6.19(VSSA) U6.20(VREF-)
NetD4_K: D4.K R29.1
NetERR_A: ERR.A R39#1.2
NetPOW_A: POW.A R1#1.2
NetR38#1_2: R38#1.2 RUN.A

Not connected (* = marked no-connect by the designer): U6 73(NC)

### Notes on the sheet
- USB接口
- MCU
- SPI_FALSH
- 核心板引出接口
- (in symbol CAPACITOR POL) +

### Library data of the parts
BATT1 = Battery: Published: 24-Mar-1999; LatestRevisionDate: 17-Jul-2002; LatestRevisionNote: Re-released for DXP Platform.; PackageReference: BAT-2; Publisher: Altium Limited; PackageDescription: Battery; 2 Leads
C8#2 C15#1 C31-C35 = CAP: Capacitor
C14#1 = CAPACITOR POL: Capacitor
C26#2 C27#1 C29#1 C30 C36 C37 = C
D4 = 二极管
ERR POW RUN = LED
J1#2 = 物联网核心板
L3 L4 R18-R20 R21#1 R29 = R
R1#1 R14#2 R15#2 R16#2 R17 R38#1 R39#1 = RES2
U7 = MAX809/810
Y1 = XTAL_32: Crystal Oscillator; Published: 8-Jun-2000; LatestRevisionDate: 17-Jul-2002; LatestRevisionNote: Re-released for DXP Platform.; Publisher: Altium Limited; PackageReference: R38
Y2 = XTAL: Crystal Oscillator; Published: *; LatestRevisionDate: *; LatestRevisionNote: *; Publisher: *

## Sheet 电源板.SchDoc: 阿波罗简易型控制器电源板
size A4; Revision: V1.2
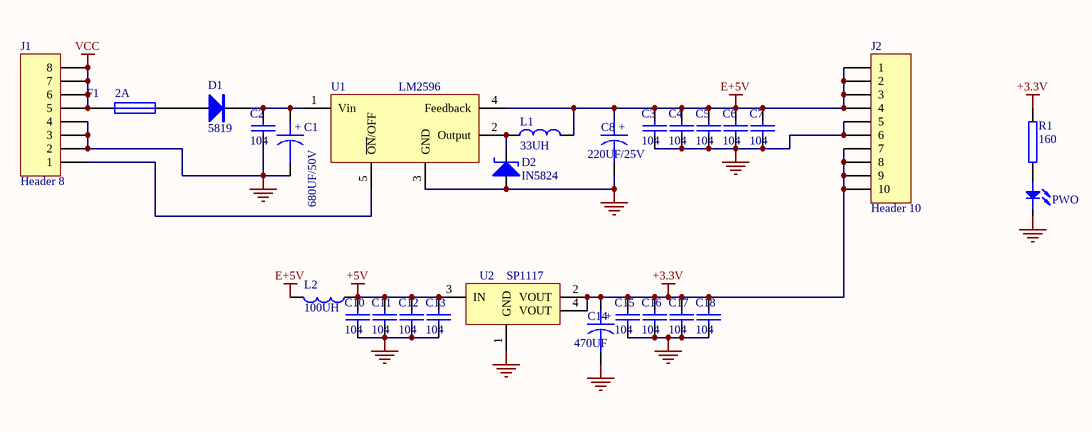
[diagram p3: 电源板.SchDoc]

### Parts
(Parts that share a designator on the sheet are numbered #1, #2 ... from top to bottom, then left to right.)
C1#2  680UF/50V  [固态电容]
C2#2  104  [0603A]
C3#2  104  [0603A]
C4#2  104  [0603A]
C5#2  104  [0603A]
C6#2  104  [0603A]
C7#2  104  [0603A]
C8#3  220UF/25V  [固态电容]
C10  104  [0603A]
C11  104  [0603A]
C12  104  [0603A]
C13  104  [0603A]
C14#2  470UF  [固态电容]
C15#2  104  [0603A]
C16  104  [0603A]
C17  104  [0603A]
C18#2  104  [0603A]
D1#1  5819  [贴片二极管]
D2#1  IN5824  [贴片二极管]
F1  2A  [自恢复保险丝 - duplicate]
J1#3  Header 8  [2.0排针2X4]
J2#2  Header 10  [2.0排针2X10]
L1  33UH  [SMD-100]
L2  100UH  [1206C]
PWO  LED  [SMDLED]  (value not drawn)
R1#2  160  [0603A]
U1#2  LM2596  [TO-263-5]
U2  SP1117  [SOT223]

### Nets
+3.3V: C14#2.1 C15#2.1 C16.1 C17.1 C18#2.1 J2#2.7 J2#2.8 J2#2.9 J2#2.10 R1#2.1 U2.2(VOUT) U2.4(VOUT)
+5V: C10.1 C11.1 C12.1 C13.1 L2.2 U2.3(IN)
E+5V: C3#2.2 C4#2.2 C5#2.2 C6#2.2 C7#2.2 C8#3.1 J2#2.1 J2#2.2 J2#2.3 J2#2.4 L1.1 L2.1 U1#2.4(Feedback)
GND: C1#2.2 C2#2.1 C3#2.1 C4#2.1 C5#2.1 C6#2.1 C7#2.1 C8#3.2 C10.2 C11.2 C12.2 C13.2 C14#2.2 C15#2.2 C16.2 C17.2 C18#2.2 D2#1.A J1#3.2 J1#3.3 J1#3.4 J2#2.5 J2#2.6 PWO.K U1#2.3(GND) U2.1(GND)
VCC: F1.1 J1#3.5 J1#3.6 J1#3.7 J1#3.8
NetC1#2_1: C1#2.1 C2#2.2 D1#1.K U1#2.1(Vin)
NetD1#1_A: D1#1.A F1.2
NetD2#1_K: D2#1.K L1.2 U1#2.2(Output)
NetJ1#3_1: J1#3.1 U1#2.5(~{ON}/OFF)
NetPWO_A: PWO.A R1#2.2

### Notes on the sheet
- (in symbol CAPACITOR POL) +

### Library data of the parts
C1#2 C8#3 C14#2 = CAPACITOR POL: Capacitor
C2#2 C3#2 C4#2 C5#2 C6#2 C7#2 C10-C13 C15#2 C16 C17 C18#2 = CAP: Capacitor
D1#1 = 二极管
D2#1 = 肖特基二极管
F1 = Fuse 1: Fuse; Published: 8-Jun-2000; LatestRevisionDate: 17-Jul-2002; LatestRevisionNote: Re-released for DXP Platform.; PackageReference: PIN-W2/E2.8; Publisher: Altium Limited
J1#3 = Header 8: Header, 8-Pin; LatestRevisionDate: 17-Jul-2002; LatestRevisionNote: Re-released for DXP Platform.; Publisher: Altium Limited
J2#2 = Header 10: Header, 10-Pin; LatestRevisionDate: 17-Jul-2002; LatestRevisionNote: Re-released for DXP Platform.; Publisher: Altium Limited
L1 L2 = L1
R1#2 = RES2

## Sheet 八进八出.SchDoc: 阿波罗八进八出控制器
size A4; Revision: V1.2; SheetNumber: 0; SheetTotal: 0
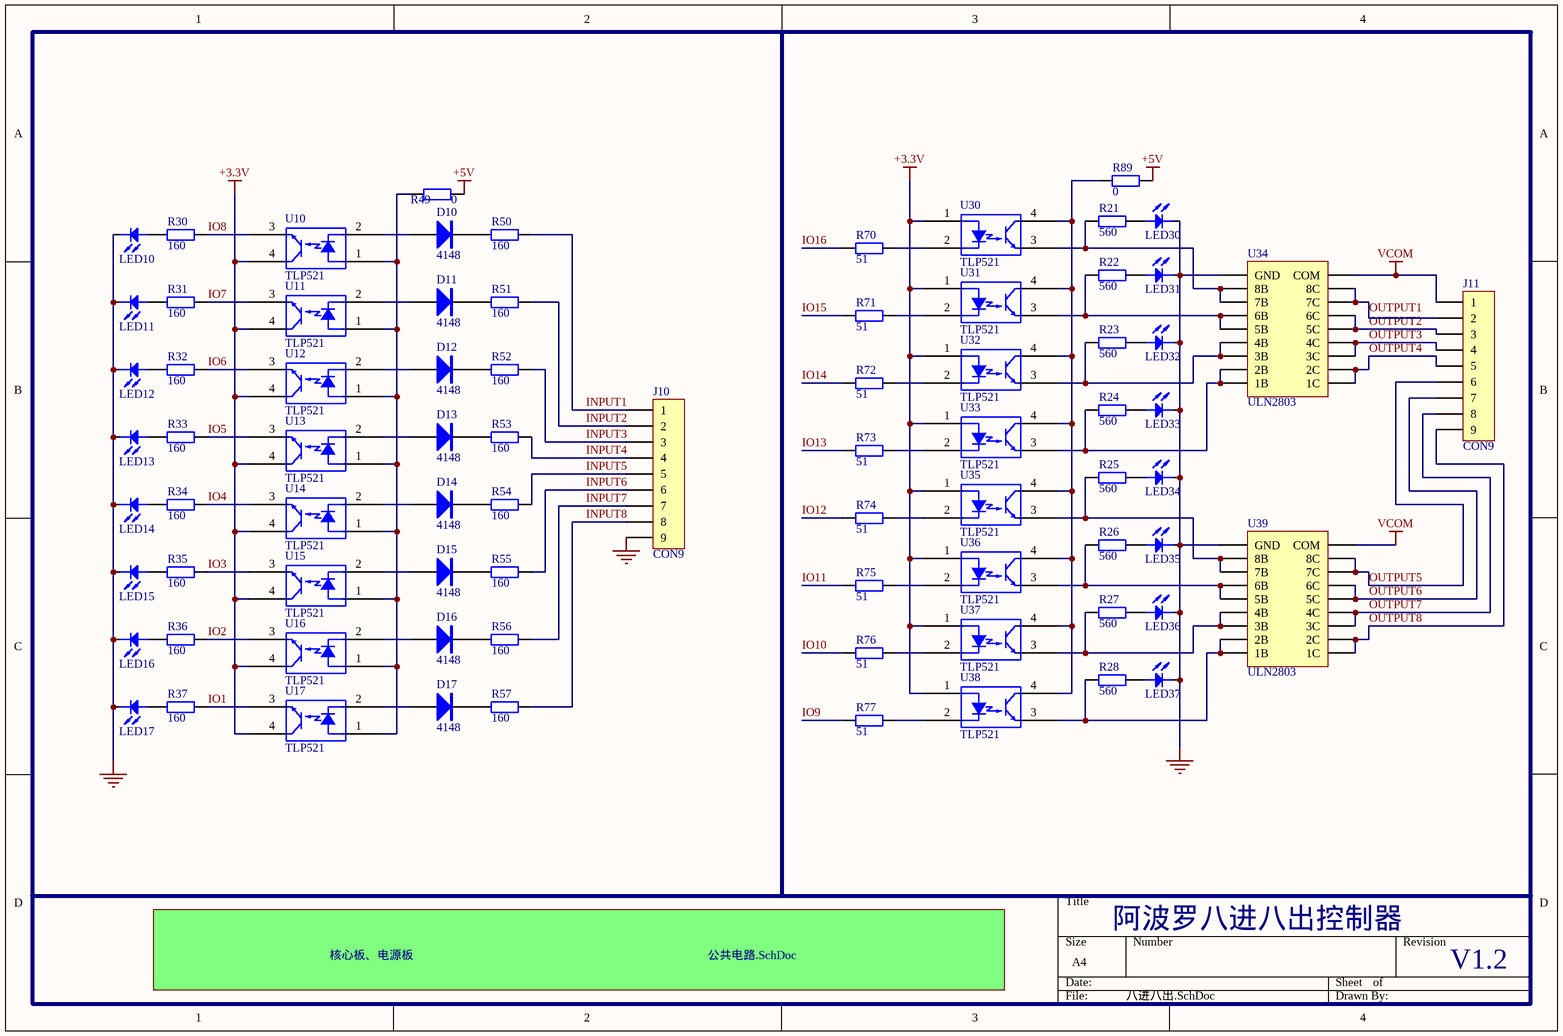
[diagram p4: 八进八出.SchDoc]

### Parts
(Parts that share a designator on the sheet are numbered #1, #2 ... from top to bottom, then left to right.)
D10#1  4148  [贴片二极管]
D11#1  4148  [贴片二极管]
D12#1  4148  [贴片二极管]
D13#1  4148  [贴片二极管]
D14#1  4148  [贴片二极管]
D15#1  4148  [贴片二极管]
D16#1  4148  [贴片二极管]
D17#1  4148  [贴片二极管]
J10#1  CON9  [CON9-5.1卧]
J11#1  CON9  [CON9-5.1卧]
LED10#1  LED  [LED2.5]  (value not drawn)
LED11#1  LED  [LED2.5]  (value not drawn)
LED12#1  LED  [LED2.5]  (value not drawn)
LED13#1  LED  [LED2.5]  (value not drawn)
LED14#1  LED  [LED2.5]  (value not drawn)
LED15#1  LED  [LED2.5]  (value not drawn)
LED16#1  LED  [LED2.5]  (value not drawn)
LED17#1  LED  [LED2.5]  (value not drawn)
LED30#1  LED  [LED2.5]  (value not drawn)
LED31#1  LED  [LED2.5]  (value not drawn)
LED32#1  LED  [LED2.5]  (value not drawn)
LED33#1  LED  [LED2.5]  (value not drawn)
LED34#1  LED  [LED2.5]  (value not drawn)
LED35#1  LED  [LED2.5]  (value not drawn)
LED36#1  LED  [LED2.5]  (value not drawn)
LED37#1  LED  [LED2.5]  (value not drawn)
R21#2  560  [0603A]
R22#1  560  [0603A]
R23#1  560  [0603A]
R24#1  560  [0603A]
R25#1  560  [0603A]
R26#1  560  [0603A]
R27#1  560  [0603A]
R28#1  560  [0603A]
R30#1  160  [0603A]
R31#1  160  [0603A]
R32#1  160  [0603A]
R33#1  160  [0603A]
R34#1  160  [0603A]
R35#1  160  [0603A]
R36#1  160  [0603A]
R37#1  160  [0603A]
R49#1  0  [0603A]
R50#1  160  [0603A]
R51#1  160  [0603A]
R52#1  160  [0603A]
R53#1  160  [0603A]
R54#1  160  [0603A]
R55#1  160  [0603A]
R56#1  160  [0603A]
R57#1  160  [0603A]
R70#1  51  [0603A]
R71#1  51  [0603A]
R72#1  51  [0603A]
R73#1  51  [0603A]
R74#1  51  [0603A]
R75#1  51  [0603A]
R76#1  51  [0603A]
R77#1  51  [0603A]
R89#1  0  [0603A]
U10#1  TLP521  [PC817]
U11#1  TLP521  [PC817]
U12#1  TLP521  [PC817]
U13#1  TLP521  [PC817]
U14#1  TLP521  [PC817]
U15#1  TLP521  [PC817]
U16#1  TLP521  [PC817]
U17#1  TLP521  [PC817]
U30#1  TLP521  [PC817]
U31#1  TLP521  [PC817]
U32#1  TLP521  [PC817]
U33#1  TLP521  [PC817]
U34#1  ULN2803  [sol18]
U35#1  TLP521  [PC817]
U36#1  TLP521  [PC817]
U37#1  TLP521  [PC817]
U38#1  TLP521  [PC817]
U39#1  ULN2803  [sol18]

### Sub-sheets
核心板、电源板 = 公共电路.SchDoc: no entries

### Nets
+3.3V: U10#1.4(COL) U11#1.4(COL) U12#1.4(COL) U13#1.4(COL) U14#1.4(COL) U15#1.4(COL) U16#1.4(COL) U17#1.4(COL) U30#1.1(ANODE) U31#1.1(ANODE) U32#1.1(ANODE) U33#1.1(ANODE) U35#1.1(ANODE) U36#1.1(ANODE) U37#1.1(ANODE) U38#1.1(ANODE)
+5V: R49#1.2 R89#1.2
GND: J10#1.9 LED10#1.K LED11#1.K LED12#1.K LED13#1.K LED14#1.K LED15#1.K LED16#1.K LED17#1.K LED30#1.K LED31#1.K LED32#1.K LED33#1.K LED34#1.K LED35#1.K LED36#1.K LED37#1.K U34#1.9(GND) U39#1.9(GND)
VCOM: J11#1.1 U34#1.10(COM) U39#1.10(COM)
INPUT1: J10#1.1 R50#1.2
INPUT2: J10#1.2 R51#1.2
INPUT3: J10#1.3 R52#1.2
INPUT4: J10#1.4 R53#1.2
INPUT5: J10#1.5 R54#1.2
INPUT6: J10#1.6 R55#1.2
INPUT7: J10#1.7 R56#1.2
INPUT8: J10#1.8 R57#1.2
IO1: R37#1.1 U17#1.3(EMIT)
IO2: R36#1.1 U16#1.3(EMIT)
IO3: R35#1.1 U15#1.3(EMIT)
IO4: R34#1.1 U14#1.3(EMIT)
IO5: R33#1.1 U13#1.3(EMIT)
IO6: R32#1.1 U12#1.3(EMIT)
IO7: R31#1.1 U11#1.3(EMIT)
IO8: R30#1.1 U10#1.3(EMIT)
IO9: R77#1.1
IO10: R76#1.1
IO11: R75#1.1
IO12: R74#1.1
IO13: R73#1.1
IO14: R72#1.1
IO15: R71#1.1
IO16: R70#1.1
OUTPUT1: J11#1.2 U34#1.11(8C) U34#1.12(7C)
OUTPUT2: J11#1.3 U34#1.13(6C) U34#1.14(5C)
OUTPUT3: J11#1.4 U34#1.15(4C) U34#1.16(3C)
OUTPUT4: J11#1.5 U34#1.17(2C) U34#1.18(1C)
OUTPUT5: J11#1.6 U39#1.11(8C) U39#1.12(7C)
OUTPUT6: J11#1.7 U39#1.13(6C) U39#1.14(5C)
OUTPUT7: J11#1.8 U39#1.15(4C) U39#1.16(3C)
OUTPUT8: J11#1.9 U39#1.17(2C) U39#1.18(1C)
NetD10#1_A: D10#1.A U10#1.2(CATH)
NetD10#1_K: D10#1.K R50#1.1
NetD11#1_A: D11#1.A U11#1.2(CATH)
NetD11#1_K: D11#1.K R51#1.1
NetD12#1_A: D12#1.A U12#1.2(CATH)
NetD12#1_K: D12#1.K R52#1.1
NetD13#1_A: D13#1.A U13#1.2(CATH)
NetD13#1_K: D13#1.K R53#1.1
NetD14#1_A: D14#1.A U14#1.2(CATH)
NetD14#1_K: D14#1.K R54#1.1
NetD15#1_A: D15#1.A U15#1.2(CATH)
NetD15#1_K: D15#1.K R55#1.1
NetD16#1_A: D16#1.A U16#1.2(CATH)
NetD16#1_K: D16#1.K R56#1.1
NetD17#1_A: D17#1.A U17#1.2(CATH)
NetD17#1_K: D17#1.K R57#1.1
NetLED10#1_A: LED10#1.A R30#1.2
NetLED11#1_A: LED11#1.A R31#1.2
NetLED12#1_A: LED12#1.A R32#1.2
NetLED13#1_A: LED13#1.A R33#1.2
NetLED14#1_A: LED14#1.A R34#1.2
NetLED15#1_A: LED15#1.A R35#1.2
NetLED16#1_A: LED16#1.A R36#1.2
NetLED17#1_A: LED17#1.A R37#1.2
NetLED30#1_A: LED30#1.A R21#2.2
NetLED31#1_A: LED31#1.A R22#1.2
NetLED32#1_A: LED32#1.A R23#1.2
NetLED33#1_A: LED33#1.A R24#1.2
NetLED34#1_A: LED34#1.A R25#1.2
NetLED35#1_A: LED35#1.A R26#1.2
NetLED36#1_A: LED36#1.A R27#1.2
NetLED37#1_A: LED37#1.A R28#1.2
NetR21#2_1: R21#2.1 U30#1.3(EMIT) U34#1.7(7B) U34#1.8(8B)
NetR22#1_1: R22#1.1 U31#1.3(EMIT) U34#1.5(5B) U34#1.6(6B)
NetR23#1_1: R23#1.1 U32#1.3(EMIT) U34#1.3(3B) U34#1.4(4B)
NetR24#1_1: R24#1.1 U33#1.3(EMIT) U34#1.1(1B) U34#1.2(2B)
NetR25#1_1: R25#1.1 U35#1.3(EMIT) U39#1.7(7B) U39#1.8(8B)
NetR26#1_1: R26#1.1 U36#1.3(EMIT) U39#1.5(5B) U39#1.6(6B)
NetR27#1_1: R27#1.1 U37#1.3(EMIT) U39#1.3(3B) U39#1.4(4B)
NetR28#1_1: R28#1.1 U38#1.3(EMIT) U39#1.1(1B) U39#1.2(2B)
NetR49#1_1: R49#1.1 U10#1.1(ANODE) U11#1.1(ANODE) U12#1.1(ANODE) U13#1.1(ANODE) U14#1.1(ANODE) U15#1.1(ANODE) U16#1.1(ANODE) U17#1.1(ANODE)
NetR70#1_2: R70#1.2 U30#1.2(CATH)
NetR71#1_2: R71#1.2 U31#1.2(CATH)
NetR72#1_2: R72#1.2 U32#1.2(CATH)
NetR73#1_2: R73#1.2 U33#1.2(CATH)
NetR74#1_2: R74#1.2 U35#1.2(CATH)
NetR75#1_2: R75#1.2 U36#1.2(CATH)
NetR76#1_2: R76#1.2 U37#1.2(CATH)
NetR77#1_2: R77#1.2 U38#1.2(CATH)
NetR89#1_1: R89#1.1 U30#1.4(COL) U31#1.4(COL) U32#1.4(COL) U33#1.4(COL) U35#1.4(COL) U36#1.4(COL) U37#1.4(COL) U38#1.4(COL)

### Library data of the parts
D10#1 D11#1 D12#1 D13#1 D14#1 D15#1 D16#1 D17#1 = 二极管
R21#2 R22#1 R23#1 R24#1 R25#1 R26#1 R27#1 R28#1 R30#1 R31#1 R32#1 R33#1 R34#1 R35#1 R36#1 R37#1 R49#1 R50#1 R51#1 R52#1 R53#1 R54#1 R55#1 R56#1 R57#1 R70#1 R71#1 R72#1 R73#1 R74#1 R75#1 R76#1 R77#1 R89#1 = Res2: Resistor; Value: 1K; Published: 8-Jun-2000; LatestRevisionDate: 17-Jul-2002; LatestRevisionNote: Re-released for DXP Platform.; PackageReference: AXIAL-0.4; Publisher: Altium Limited
U10#1 U11#1 U12#1 U13#1 U14#1 U15#1 U16#1 U17#1 U30#1 U31#1 U32#1 U33#1 U35#1 U36#1 U37#1 U38#1 = TLP521-1: Single NPN PhotoTransistor OptoCoupler.

## Sheet 公共电路.SchDoc: 阿波罗工业控制器公共电路
size A4; Organization: *月无声智控部; Revision: V1.4; MakeTime: 2014年3月4日
Used 7 times, as channels 核心板、电源板, MCU及电源, MCU及电源, MCU及电源, , MCU及电源, MCU及电源. Parts and nets are listed once, with the designators drawn on the sheet.
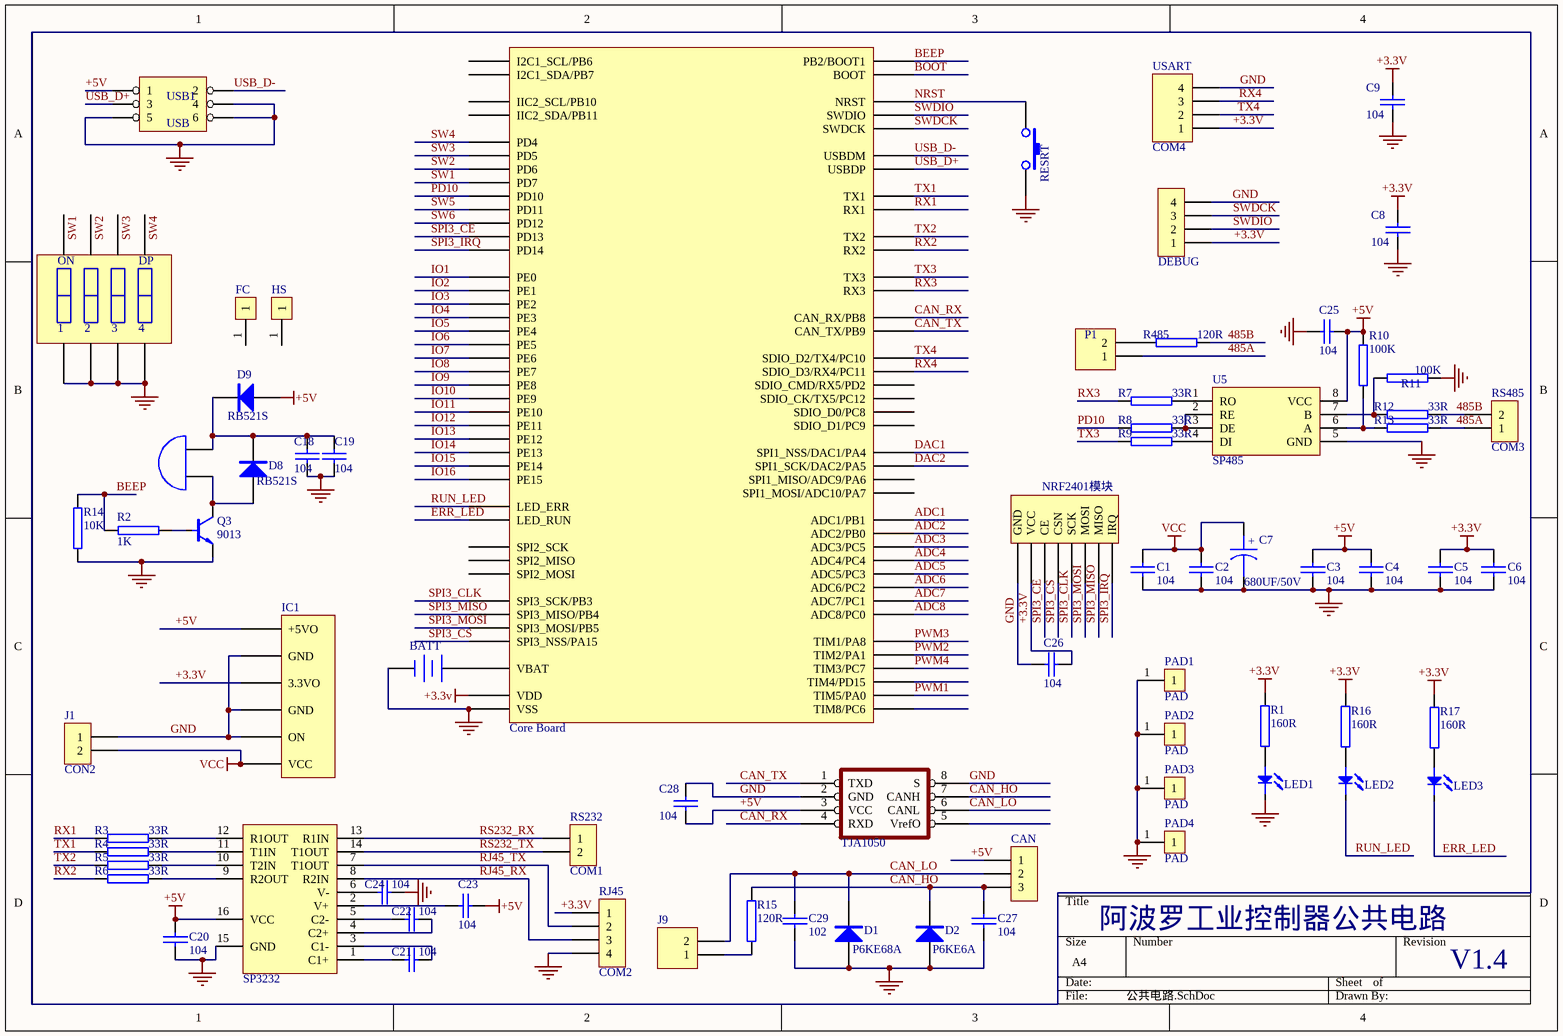
[diagram p5: 公共电路.SchDoc]

### Parts
BATT  (no value)  [MINI-BAT]
C1  104  [0603A]
C2  104  [0603A]
C3  104  [0603A]
C4  104  [0603A]
C5  104  [0603A]
C6  104  [0603A]
C7  680UF/50V  [电解电容10mm]
C8  104  [0603A]
C9  104  [0603A]
C18  104  [0603A]
C19  104  [0603A]
C20  104  [0603A]
C21  104  [0603A]
C22  104  [0603A]
C23  104  [0603A]
C24  104  [0603A]
C25  104  [0603A]
C26  104  [0603A]
C27  104  [0603A]
C28  104  [0603A]
C29  102  [0603A]
CAN  CON3  (value not drawn)
D1  P6KE68A
D2  P6KE6A
D8  RB521S
D9  RB521S
FC  (no value)  [fc]
HS  (no value)  [HS]
IC1  (no value)
IC2  Core Board  [核心板-物联网1]
J1  CON2
J2  DEBUG  [HDR1X4]
J7  NRF2401模块  [NRF24L01]
J9  (no value)  [HDR1X2]
K1  拨码开关*4  (value not drawn)
LED1  PLED  [LED2.5]  (value not drawn)
LED2  RUN  [LED2.5]  (value not drawn)
LED3  ERR  [LED2.5]  (value not drawn)
P1  (no value)  [HDR1X2]
PAD1  PAD  [PAD]
PAD2  PAD  [PAD]
PAD3  PAD  [PAD]
PAD4  PAD  [PAD]
Q3  9013  [SOT23]
R1  160R  [0603A]
R2  1K  [0603A]
R3  33R  [0603A]
R4  33R  [0603A]
R5  33R  [0603A]
R6  33R  [0603A]
R7  33R  [0603A]
R8  33R  [0603A]
R9  33R  [0603A]
R10  100K  [0603A]
R11  100K  [0603A]
R12  33R  [0603A]
R13  33R  [0603A]
R14  10K  [0603A]
R15  120R  [0603A]
R16  160R  [0603A]
R17  160R  [0603A]
R485  120R  [0603A]
RJ45  COM2  [HDR1X4]
RS232  COM1
RS485  COM3
S2  RESRT  [SW-PB2]
U3  (no value)
U4  SP3232  [TSSOP16]
U5  SP485  [SO8_L]
U6  TJA1050  [SO8_L]
USART  COM4  [HDR1X4]
USB1  USB  [USB-B3]

### Nets
+3.3V: C5.1 C6.1 C8.1 C9.1 C26.2 IC1.3(3.3VO) IC2.2(VDD) J2.1 J7.2(VCC) R1.1 R16.1 R17.1 RJ45.1 USART.1
+5V: C3.1 C4.1 C20.1 C23.2 C25.2 C28.2 CAN.1 D9.A IC1.1(+5VO) R10.2 U4.16(VCC) U5.8(VCC) U6.3(VCC) USB1.1
GND: BATT.2(-) C1.2 C2.2 C3.2 C4.2 C5.2 C6.2 C7.2 C8.2 C9.2 C18.2 C19.2 C20.2 C24.2 C25.1 C26.1 C27.2 C28.1 C29.1 D1.A D2.A IC1.2(GND) IC1.4(GND) IC1.5(ON) IC2.1(VSS) J1.1 J2.4 J7.1(GND) K1.5 K1.6 K1.7 K1.8 LED1.K PAD1.1 PAD2.1 PAD3.1 PAD4.1 Q3.2(e) R11.2 R14.1 RJ45.4 S2.2 U4.15(GND) U5.5(GND) U6.2(GND) U6.8(S) USART.4 USB1.4 USB1.5 USB1.6
VCC: C1.1 C2.1 C7.1 IC1.6(VCC) J1.2
485A: P1.1 R13.2 RS485.1
485B: R12.2 R485.2 RS485.2
ADC1: IC2.33(ADC1/PB1)
ADC2: IC2.34(ADC2/PB0)
ADC3: IC2.35(ADC3/PC5)
ADC4: IC2.36(ADC4/PC4)
ADC5: IC2.48(ADC5/PC3)
ADC6: IC2.47(ADC6/PC2)
ADC7: IC2.50(ADC7/PC1)
ADC8: IC2.49(ADC8/PC0)
BEEP: IC2.31(PB2/BOOT1) R2.1 R14.2
BOOT: IC2.3(BOOT)
CAN_HO: C27.1 CAN.3 D2.K R15.1 U6.7(CANH)
CAN_LO: C29.2 CAN.2 D1.K J9.2 U6.6(CANL)
CAN_RX: IC2.68(CAN_RX/PB8) U6.4(RXD)
CAN_TX: IC2.67(CAN_TX/PB9) U6.1(TXD)
DAC1: IC2.39(SPI1_NSS/DAC1/PA4)
DAC2: IC2.40(SPI1_SCK/DAC2/PA5)
ERR_LED: IC2.12(LED_RUN) LED3.K
IO1: IC2.58(PE0)
IO2: IC2.57(PE1)
IO3: IC2.56(PE2)
IO4: IC2.55(PE3)
IO5: IC2.54(PE4)
IO6: IC2.53(PE5)
IO7: IC2.52(PE6)
IO8: IC2.51(PE7)
IO9: IC2.30(PE8)
IO10: IC2.29(PE9)
IO11: IC2.28(PE10)
IO12: IC2.27(PE11)
IO13: IC2.26(PE12)
IO14: IC2.25(PE13)
IO15: IC2.24(PE14)
IO16: IC2.23(PE15)
NRST: IC2.4(NRST) S2.1
PD10: IC2.13(PD10) R8.1
PWM1: IC2.45(TIM5/PA0)
PWM2: IC2.46(TIM2/PA1)
PWM3: IC2.43(TIM1/PA8)
PWM4: IC2.44(TIM3/PC7)
RJ45_RX: RJ45.3 U4.8(R2IN)
RJ45_TX: RJ45.2 U4.7(T1OUT)
RS232_RX: RS232.1 U4.13(R1IN)
RS232_TX: RS232.2 U4.14(T1OUT)
RUN_LED: IC2.11(LED_ERR) LED2.K
RX1: IC2.10(RX1) R3.1
RX2: IC2.18(RX2) R6.1
RX3: IC2.20(RX3) R7.1
RX4: IC2.80(SDIO_D3/RX4/PC11) USART.3
SPI3_CE: IC2.60(PD13) J7.3(CE)
SPI3_CLK: IC2.73(SPI3_SCK/PB3) J7.5(SCK)
SPI3_CS: IC2.74(SPI3_NSS/PA15) J7.4(CSN)
SPI3_IRQ: IC2.59(PD14) J7.8(IRQ)
SPI3_MISO: IC2.72(SPI3_MISO/PB4) J7.7(MISO)
SPI3_MOSI: IC2.71(SPI3_MOSI/PB5) J7.6(MOSI)
SW1: IC2.66(PD7) K1.1
SW2: IC2.65(PD6) K1.2
SW3: IC2.64(PD5) K1.3
SW4: IC2.63(PD4) K1.4
SW5: IC2.62(PD11)
SW6: IC2.61(PD12)
SWDCK: IC2.6(SWDCK) J2.3
SWDIO: IC2.5(SWDIO) J2.2
TX1: IC2.9(TX1) R4.1
TX2: IC2.17(TX2) R5.1
TX3: IC2.19(TX3) R9.1
TX4: IC2.79(SDIO_D2/TX4/PC10) USART.2
USB_D+: IC2.8(USBDP) USB1.3
USB_D-: IC2.7(USBDM) USB1.2
NetBATT_1: BATT.1(+) IC2.32(VBAT)
NetC18_1: C18.1 C19.1 D8.K D9.K U3.1(A)
NetC21_1: C21.1 U4.1(C1+)
NetC21_2: C21.2 U4.3(C1-)
NetC22_1: C22.1 U4.5(C2-)
NetC22_2: C22.2 U4.4(C2+)
NetC23_1: C23.1 U4.2(V+)
NetC24_1: C24.1 U4.6(V-)
NetD8_A: D8.A Q3.3(c) U3.2(B)
NetJ9_1: J9.1 R15.2
NetLED1_A: LED1.A R1.2
NetLED2_A: LED2.A R16.2
NetLED3_A: LED3.A R17.2
NetP1_2: P1.2 R485.1
NetQ3_1: Q3.1(b) R2.2
NetR3_2: R3.2 U4.12(R1OUT)
NetR4_2: R4.2 U4.11(T1IN)
NetR5_2: R5.2 U4.10(T2IN)
NetR6_2: R6.2 U4.9(R2OUT)
NetR7_2: R7.2 U5.1(RO)
NetR8_2: R8.2 U5.2(RE) U5.3(DE)
NetR9_2: R9.2 U5.4(DI)
NetR10_1: R10.1 R13.1 U5.6(A)
NetR11_1: R11.1 R12.1 U5.7(B)

Not connected (* = marked no-connect by the designer): FC 1; HS 1; IC2 14(SPI2_SCK) 15(SPI2_MISO) 16(SPI2_MOSI) 21(IIC2_SDA/PB11) 22(IIC2_SCL/PB10) 37(SPI1_MISO/ADC9/PA6) 38(SPI1_MOSI/ADC10/PA7) 41(TIM8/PC6) 42(TIM4/PD15) 69(I2C1_SDA/PB7) 70(I2C1_SCL/PB6) 75(SDIO_D1/PC9) 76(SDIO_D0/PC8) 77(SDIO_CMD/RX5/PD2) 78(SDIO_CK/TX5/PC12); U6 5(VrefO)

### Channels
核心板、电源板: designators BATT=BATT_核心板、电源板 C1=C1_核心板、电源板 C2=C2_核心板、电源板 C3=C3_核心板、电源板 C4=C4_核心板、电源板 C5=C5_核心板、电源板 C6=C6_核心板、电源板 C7=C7_核心板、电源板 C8=C8_核心板、电源板 C9=C9_核心板、电源板 C18=C18_核心板、电源板 C19=C19_核心板、电源板 C20=C20_核心板、电源板 C21=C21_核心板、电源板 C22=C22_核心板、电源板 C23=C23_核心板、电源板 C24=C24_核心板、电源板 C25=C25_核心板、电源板 C26=C26_核心板、电源板 C27=C27#2 C28=C28_核心板、电源板 C29=C29#2 CAN=CAN_核心板、电源板 D1=D1#2 D2=D2#2 D8=D8_核心板、电源板 D9=D9_核心板、电源板 FC=FC_核心板、电源板 HS=HS_核心板、电源板 IC1=IC1_核心板、电源板 IC2=IC2_核心板、电源板 J1=J1_核心板、电源板 J2=J2_核心板、电源板 J7=J7_核心板、电源板 J9=J9_核心板、电源板 K1=K1_核心板、电源板 LED1=LED1_核心板、电源板 LED2=LED2_核心板、电源板 LED3=LED3_核心板、电源板 P1=P1_核心板、电源板 PAD1=PAD1_核心板、电源板 PAD2=PAD2_核心板、电源板 PAD3=PAD3_核心板、电源板 PAD4=PAD4_核心板、电源板 Q3=Q3_核心板、电源板 R1=R1_核心板、电源板 R2=R2_核心板、电源板 R3=R3_核心板、电源板 R4=R4_核心板、电源板 R5=R5_核心板、电源板 R6=R6_核心板、电源板 R7=R7_核心板、电源板 R8=R8_核心板、电源板 R9=R9_核心板、电源板 R10=R10_核心板、电源板 R11=R11_核心板、电源板 R12=R12_核心板、电源板 R13=R13_核心板、电源板 R14=R14_核心板、电源板 R15=R15_核心板、电源板 R16=R16_核心板、电源板 R17=R17_核心板、电源板 R485=R485_核心板、电源板 RJ45=RJ45_核心板、电源板 RS232=RS232_核心板、电源板 RS485=RS485_核心板、电源板 S2=S2_核心板、电源板 U3=U3_核心板、电源板 U4=U4 U5=U5_核心板、电源板 U6=U6_核心板、电源板 USART=COM4#2 USB1=USB1_核心板、电源板
MCU及电源: designators end in _MCU及电源#1
MCU及电源: designators end in _MCU及电源#2
MCU及电源: designators end in _MCU及电源#3
(top): designators end in _
MCU及电源: designators end in _MCU及电源#4
MCU及电源: designators end in _MCU及电源#5

### Notes on the sheet
- (in symbol CAPACITOR POL) +
- (in symbol 拨码开关*4) ON; DP

### Library data of the parts
BATT = Battery: XH414H; Published: 24-Mar-1999; LatestRevisionDate: 17-Jul-2002; LatestRevisionNote: Re-released for DXP Platform.; PackageReference: BAT-2; Publisher: Altium Limited; PackageDescription: Battery; 2 Leads
C1-C6 C8 C9 C18-C29 = CAP: Capacitor
C7 = CAPACITOR POL: Capacitor
FC HS = PAD
IC2 = 物联网核心板
J2 RJ45 = CON4
J9 P1 = Header 2: Header, 2-Pin; LatestRevisionDate: 17-Jul-2002; LatestRevisionNote: Re-released for DXP Platform.; Publisher: Altium Limited
LED1-LED3 = LED
Q3 = NPN
R1-R17 R485 = RES2
RS232 RS485 = CON2
S2 = SW-PB
U4 = SP3232EEA
USART = Header 4: Header, 4-Pin; LatestRevisionDate: 17-Jul-2002; LatestRevisionNote: Re-released for DXP Platform.; Publisher: Altium Limited
USB1 = HEADER 3X2

## Sheet 十六路输入.SchDoc: 阿波罗十六路输入控制器
size A4; Revision: V1.0; SheetNumber: 0; SheetTotal: 0
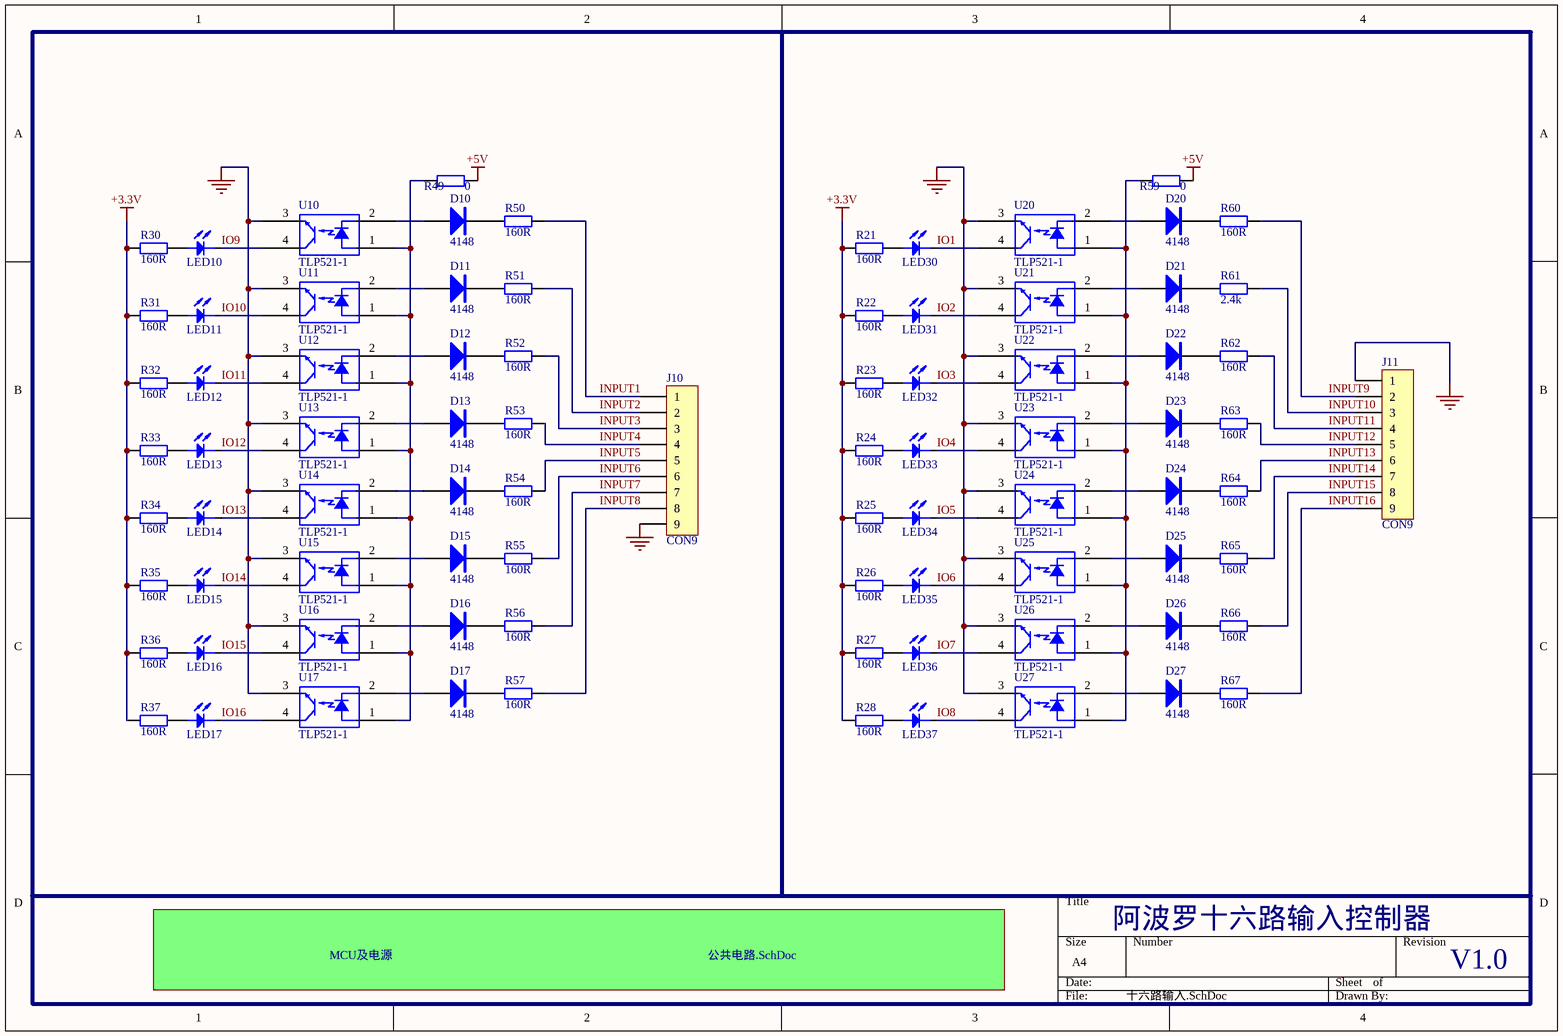
[diagram p6: 十六路输入.SchDoc]

### Parts
(Parts that share a designator on the sheet are numbered #1, #2 ... from top to bottom, then left to right.)
D10#2  4148  [贴片二极管]
D11#2  4148  [贴片二极管]
D12#2  4148  [贴片二极管]
D13#2  4148  [贴片二极管]
D14#2  4148  [贴片二极管]
D15#2  4148  [贴片二极管]
D16#2  4148  [贴片二极管]
D17#2  4148  [贴片二极管]
D20#1  4148  [贴片二极管]
D21  4148  [贴片二极管]
D22  4148  [贴片二极管]
D23  4148  [贴片二极管]
D24#1  4148  [贴片二极管]
D25#1  4148  [贴片二极管]
D26#1  4148  [贴片二极管]
D27#1  4148  [贴片二极管]
J10#2  CON9  [CON9*5.1]
J11#2  CON9  [CON9*5.1]
LED10#2  LED  [LED2.5]  (value not drawn)
LED11#2  LED  [LED2.5]  (value not drawn)
LED12#2  LED  [LED2.5]  (value not drawn)
LED13#2  LED  [LED2.5]  (value not drawn)
LED14#2  LED  [LED2.5]  (value not drawn)
LED15#2  LED  [LED2.5]  (value not drawn)
LED16#2  LED  [LED2.5]  (value not drawn)
LED17#2  LED  [LED2.5]  (value not drawn)
LED30#2  LED  [LED2.5]  (value not drawn)
LED31#2  LED  [LED2.5]  (value not drawn)
LED32#2  LED  [LED2.5]  (value not drawn)
LED33#2  LED  [LED2.5]  (value not drawn)
LED34#2  LED  [LED2.5]  (value not drawn)
LED35#2  LED  [LED2.5]  (value not drawn)
LED36#2  LED  [LED2.5]  (value not drawn)
LED37#2  LED  [LED2.5]  (value not drawn)
R21#3  160R  [0603A]
R22#2  160R  [0603A]
R23#2  160R  [0603A]
R24#2  160R  [0603A]
R25#2  160R  [0603A]
R26#2  160R  [0603A]
R27#2  160R  [0603A]
R28#2  160R  [0603A]
R30#2  160R  [0603A]
R31#2  160R  [0603A]
R32#2  160R  [0603A]
R33#2  160R  [0603A]
R34#2  160R  [0603A]
R35#2  160R  [0603A]
R36#2  160R  [0603A]
R37#2  160R  [0603A]
R49#2  0  [0603A]
R50#2  160R  [0603A]
R51#2  160R  [0603A]
R52#2  160R  [0603A]
R53#2  160R  [0603A]
R54#2  160R  [0603A]
R55#2  160R  [0603A]
R56#2  160R  [0603A]
R57#2  160R  [0603A]
R59  0  [0603A]
R60#1  160R  [0603A]
R61#1  2.4k  [0603A]
R62#1  160R  [0603A]
R63  160R  [0603A]
R64#1  160R  [0603A]
R65#1  160R  [0603A]
R66#1  160R  [0603A]
R67#1  160R  [0603A]
U10#2  TLP521-1  [PC817]
U11#2  TLP521-1  [PC817]
U12#2  TLP521-1  [PC817]
U13#2  TLP521-1  [PC817]
U14#2  TLP521-1  [PC817]
U15#2  TLP521-1  [PC817]
U16#2  TLP521-1  [PC817]
U17#2  TLP521-1  [PC817]
U20  TLP521-1  [PC817]
U21  TLP521-1  [PC817]
U22  TLP521-1  [PC817]
U23  TLP521-1  [PC817]
U24#1  TLP521-1  [PC817]
U25#1  TLP521-1  [PC817]
U26#1  TLP521-1  [PC817]
U27#1  TLP521-1  [PC817]

### Sub-sheets
MCU及电源 = 公共电路.SchDoc: no entries

### Nets
+3.3V: R21#3.1 R22#2.1 R23#2.1 R24#2.1 R25#2.1 R26#2.1 R27#2.1 R28#2.1 R30#2.1 R31#2.1 R32#2.1 R33#2.1 R34#2.1 R35#2.1 R36#2.1 R37#2.1
+5V: R49#2.2 R59.2
GND: J10#2.9 J11#2.1 U10#2.3(EMIT) U11#2.3(EMIT) U12#2.3(EMIT) U13#2.3(EMIT) U14#2.3(EMIT) U15#2.3(EMIT) U16#2.3(EMIT) U17#2.3(EMIT) U20.3(EMIT) U21.3(EMIT) U22.3(EMIT) U23.3(EMIT) U24#1.3(EMIT) U25#1.3(EMIT) U26#1.3(EMIT) U27#1.3(EMIT)
INPUT1: J10#2.1 R50#2.2
INPUT2: J10#2.2 R51#2.2
INPUT3: J10#2.3 R52#2.2
INPUT4: J10#2.4 R53#2.2
INPUT5: J10#2.5 R54#2.2
INPUT6: J10#2.6 R55#2.2
INPUT7: J10#2.7 R56#2.2
INPUT8: J10#2.8 R57#2.2
INPUT9: J11#2.2 R60#1.2
INPUT10: J11#2.3 R61#1.2
INPUT11: J11#2.4 R62#1.2
INPUT12: J11#2.5 R63.2
INPUT13: J11#2.6 R64#1.2
INPUT14: J11#2.7 R65#1.2
INPUT15: J11#2.8 R66#1.2
INPUT16: J11#2.9 R67#1.2
IO1: LED30#2.K U20.4(COL)
IO2: LED31#2.K U21.4(COL)
IO3: LED32#2.K U22.4(COL)
IO4: LED33#2.K U23.4(COL)
IO5: LED34#2.K U24#1.4(COL)
IO6: LED35#2.K U25#1.4(COL)
IO7: LED36#2.K U26#1.4(COL)
IO8: LED37#2.K U27#1.4(COL)
IO9: LED10#2.K U10#2.4(COL)
IO10: LED11#2.K U11#2.4(COL)
IO11: LED12#2.K U12#2.4(COL)
IO12: LED13#2.K U13#2.4(COL)
IO13: LED14#2.K U14#2.4(COL)
IO14: LED15#2.K U15#2.4(COL)
IO15: LED16#2.K U16#2.4(COL)
IO16: LED17#2.K U17#2.4(COL)
NetD10#2_A: D10#2.A U10#2.2(CATH)
NetD10#2_K: D10#2.K R50#2.1
NetD11#2_A: D11#2.A U11#2.2(CATH)
NetD11#2_K: D11#2.K R51#2.1
NetD12#2_A: D12#2.A U12#2.2(CATH)
NetD12#2_K: D12#2.K R52#2.1
NetD13#2_A: D13#2.A U13#2.2(CATH)
NetD13#2_K: D13#2.K R53#2.1
NetD14#2_A: D14#2.A U14#2.2(CATH)
NetD14#2_K: D14#2.K R54#2.1
NetD15#2_A: D15#2.A U15#2.2(CATH)
NetD15#2_K: D15#2.K R55#2.1
NetD16#2_A: D16#2.A U16#2.2(CATH)
NetD16#2_K: D16#2.K R56#2.1
NetD17#2_A: D17#2.A U17#2.2(CATH)
NetD17#2_K: D17#2.K R57#2.1
NetD20#1_A: D20#1.A U20.2(CATH)
NetD20#1_K: D20#1.K R60#1.1
NetD21_A: D21.A U21.2(CATH)
NetD21_K: D21.K R61#1.1
NetD22_A: D22.A U22.2(CATH)
NetD22_K: D22.K R62#1.1
NetD23_A: D23.A U23.2(CATH)
NetD23_K: D23.K R63.1
NetD24#1_A: D24#1.A U24#1.2(CATH)
NetD24#1_K: D24#1.K R64#1.1
NetD25#1_A: D25#1.A U25#1.2(CATH)
NetD25#1_K: D25#1.K R65#1.1
NetD26#1_A: D26#1.A U26#1.2(CATH)
NetD26#1_K: D26#1.K R66#1.1
NetD27#1_A: D27#1.A U27#1.2(CATH)
NetD27#1_K: D27#1.K R67#1.1
NetLED10#2_A: LED10#2.A R30#2.2
NetLED11#2_A: LED11#2.A R31#2.2
NetLED12#2_A: LED12#2.A R32#2.2
NetLED13#2_A: LED13#2.A R33#2.2
NetLED14#2_A: LED14#2.A R34#2.2
NetLED15#2_A: LED15#2.A R35#2.2
NetLED16#2_A: LED16#2.A R36#2.2
NetLED17#2_A: LED17#2.A R37#2.2
NetLED30#2_A: LED30#2.A R21#3.2
NetLED31#2_A: LED31#2.A R22#2.2
NetLED32#2_A: LED32#2.A R23#2.2
NetLED33#2_A: LED33#2.A R24#2.2
NetLED34#2_A: LED34#2.A R25#2.2
NetLED35#2_A: LED35#2.A R26#2.2
NetLED36#2_A: LED36#2.A R27#2.2
NetLED37#2_A: LED37#2.A R28#2.2
NetR49#2_1: R49#2.1 U10#2.1(ANODE) U11#2.1(ANODE) U12#2.1(ANODE) U13#2.1(ANODE) U14#2.1(ANODE) U15#2.1(ANODE) U16#2.1(ANODE) U17#2.1(ANODE)
NetR59_1: R59.1 U20.1(ANODE) U21.1(ANODE) U22.1(ANODE) U23.1(ANODE) U24#1.1(ANODE) U25#1.1(ANODE) U26#1.1(ANODE) U27#1.1(ANODE)

### Library data of the parts
D10#2 D11#2 D12#2 D13#2 D14#2 D15#2 D16#2 D17#2 D20#1 D21-D23 D24#1 D25#1 D26#1 D27#1 = 二极管
R21#3 R22#2 R23#2 R24#2 R25#2 R26#2 R27#2 R28#2 R30#2 R31#2 R32#2 R33#2 R34#2 R35#2 R36#2 R37#2 R49#2 R50#2 R51#2 R52#2 R53#2 R54#2 R55#2 R56#2 R57#2 R59 R60#1 R61#1 R62#1 R63 R64#1 R65#1 R66#1 R67#1 = Res2: Resistor; Value: 1K; Published: 8-Jun-2000; LatestRevisionDate: 17-Jul-2002; LatestRevisionNote: Re-released for DXP Platform.; PackageReference: AXIAL-0.4; Publisher: Altium Limited
U10#2 U11#2 U12#2 U13#2 U14#2 U15#2 U16#2 U17#2 U20-U23 U24#1 U25#1 U26#1 U27#1 = TLP521-1: Single NPN PhotoTransistor OptoCoupler.

## Sheet 十六路输出.SchDoc: 阿波罗十六路输出控制器
size A4; Revision: V1.0; SheetNumber: 0; SheetTotal: 0
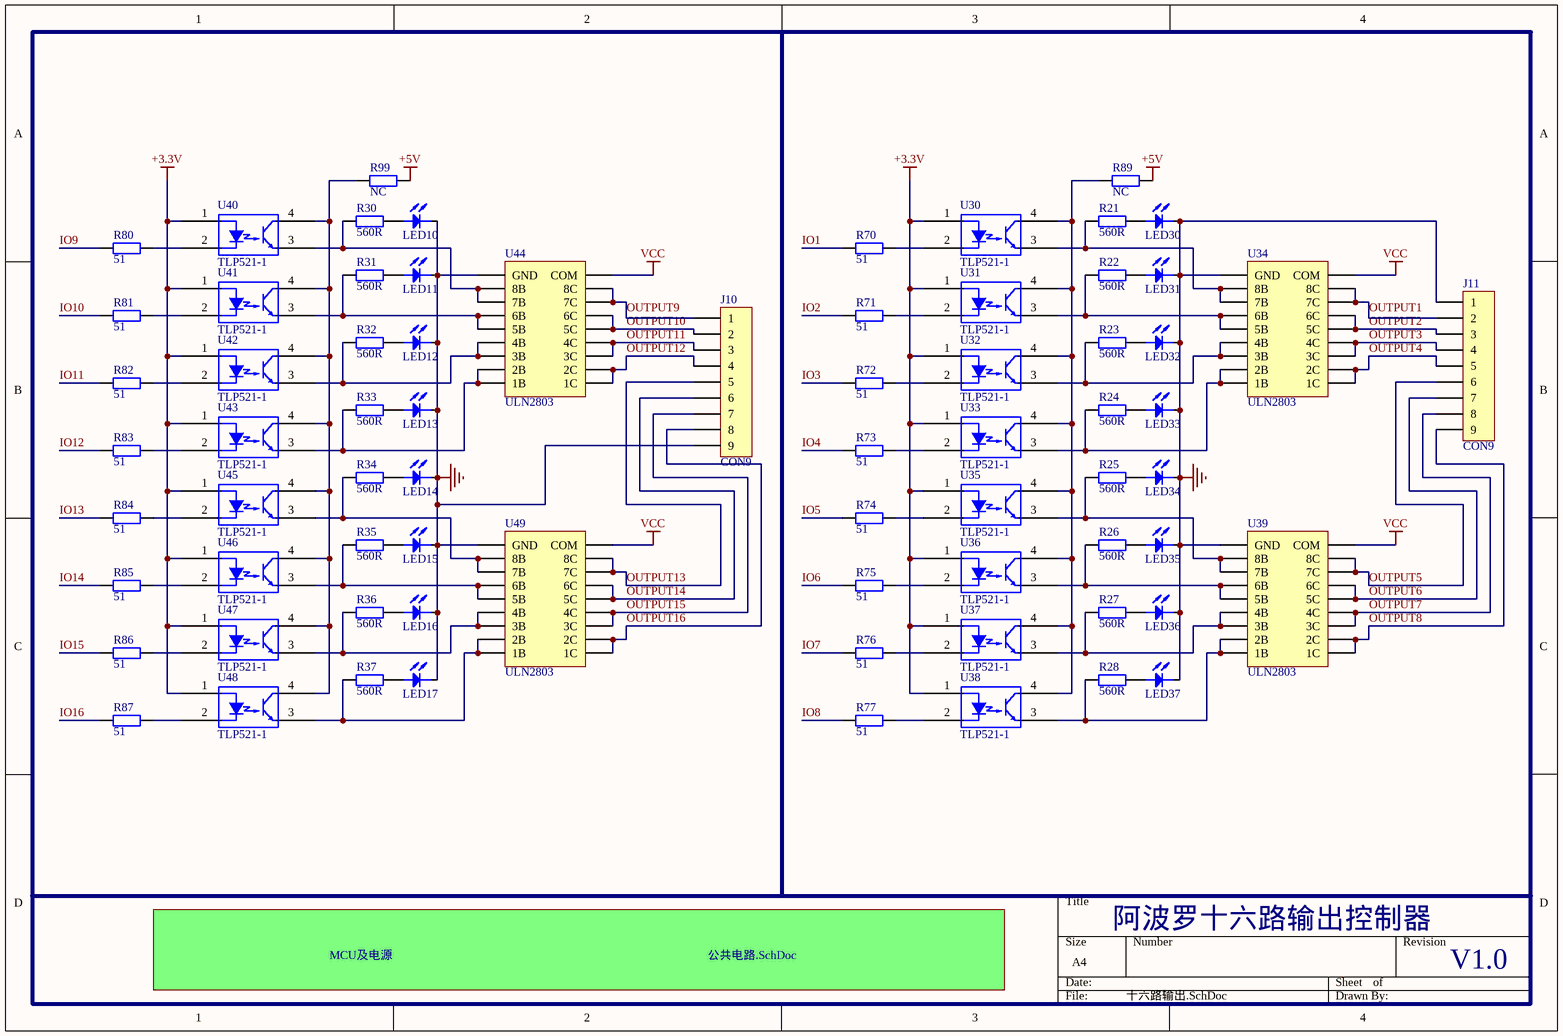
[diagram p7: 十六路输出.SchDoc]

### Parts
(Parts that share a designator on the sheet are numbered #1, #2 ... from top to bottom, then left to right.)
J10#3  CON9  [CON9*5.1]
J11#3  CON9  [CON9*5.1]
LED10#3  LED  [LED2.5]  (value not drawn)
LED11#3  LED  [LED2.5]  (value not drawn)
LED12#3  LED  [LED2.5]  (value not drawn)
LED13#3  LED  [LED2.5]  (value not drawn)
LED14#3  LED  [LED2.5]  (value not drawn)
LED15#3  LED  [LED2.5]  (value not drawn)
LED16#3  LED  [LED2.5]  (value not drawn)
LED17#3  LED  [LED2.5]  (value not drawn)
LED30#3  LED  [LED2.5]  (value not drawn)
LED31#3  LED  [LED2.5]  (value not drawn)
LED32#3  LED  [LED2.5]  (value not drawn)
LED33#3  LED  [LED2.5]  (value not drawn)
LED34#3  LED  [LED2.5]  (value not drawn)
LED35#3  LED  [LED2.5]  (value not drawn)
LED36#3  LED  [LED2.5]  (value not drawn)
LED37#3  LED  [LED2.5]  (value not drawn)
R21#4  560R  [0603A]
R22#3  560R  [0603A]
R23#3  560R  [0603A]
R24#3  560R  [0603A]
R25#3  560R  [0603A]
R26#3  560R  [0603A]
R27#3  560R  [0603A]
R28#3  560R  [0603A]
R30#3  560R  [0603A]
R31#3  560R  [0603A]
R32#3  560R  [0603A]
R33#3  560R  [0603A]
R34#3  560R  [0603A]
R35#3  560R  [0603A]
R36#3  560R  [0603A]
R37#3  560R  [0603A]
R70#2  51  [0603A]
R71#2  51  [0603A]
R72#2  51  [0603A]
R73#2  51  [0603A]
R74#2  51  [0603A]
R75#2  51  [0603A]
R76#2  51  [0603A]
R77#2  51  [0603A]
R80#1  51  [0603A]
R81  51  [0603A]
R82  51  [0603A]
R83  51  [0603A]
R84  51  [0603A]
R85  51  [0603A]
R86  51  [0603A]
R87  51  [0603A]
R89#2  NC  [0603A]
R99  NC  [0603A]
U30#2  TLP521-1  [PC817]
U31#2  TLP521-1  [PC817]
U32#2  TLP521-1  [PC817]
U33#2  TLP521-1  [PC817]
U34#2  ULN2803  [sol18]
U35#2  TLP521-1  [PC817]
U36#2  TLP521-1  [PC817]
U37#2  TLP521-1  [PC817]
U38#2  TLP521-1  [PC817]
U39#2  ULN2803  [sol18]
U40  TLP521-1  [PC817]
U41  TLP521-1  [PC817]
U42  TLP521-1  [PC817]
U43  TLP521-1  [PC817]
U44  ULN2803  [sol18]
U45  TLP521-1  [PC817]
U46  TLP521-1  [PC817]
U47  TLP521-1  [PC817]
U48  TLP521-1  [PC817]
U49  ULN2803  [sol18]

### Sub-sheets
MCU及电源 = 公共电路.SchDoc: no entries

### Nets
+3.3V: U30#2.1(ANODE) U31#2.1(ANODE) U32#2.1(ANODE) U33#2.1(ANODE) U35#2.1(ANODE) U36#2.1(ANODE) U37#2.1(ANODE) U38#2.1(ANODE) U40.1(ANODE) U41.1(ANODE) U42.1(ANODE) U43.1(ANODE) U45.1(ANODE) U46.1(ANODE) U47.1(ANODE) U48.1(ANODE)
+5V: R89#2.2 R99.2
GND: J10#3.9 J11#3.1 LED10#3.K LED11#3.K LED12#3.K LED13#3.K LED14#3.K LED15#3.K LED16#3.K LED17#3.K LED30#3.K LED31#3.K LED32#3.K LED33#3.K LED34#3.K LED35#3.K LED36#3.K LED37#3.K U34#2.9(GND) U39#2.9(GND) U44.9(GND) U49.9(GND)
VCC: U34#2.10(COM) U39#2.10(COM) U44.10(COM) U49.10(COM)
IO1: R70#2.1
IO2: R71#2.1
IO3: R72#2.1
IO4: R73#2.1
IO5: R74#2.1
IO6: R75#2.1
IO7: R76#2.1
IO8: R77#2.1
IO9: R80#1.1
IO10: R81.1
IO11: R82.1
IO12: R83.1
IO13: R84.1
IO14: R85.1
IO15: R86.1
IO16: R87.1
OUTPUT1: J11#3.2 U34#2.11(8C) U34#2.12(7C)
OUTPUT2: J11#3.3 U34#2.13(6C) U34#2.14(5C)
OUTPUT3: J11#3.4 U34#2.15(4C) U34#2.16(3C)
OUTPUT4: J11#3.5 U34#2.17(2C) U34#2.18(1C)
OUTPUT5: J11#3.6 U39#2.11(8C) U39#2.12(7C)
OUTPUT6: J11#3.7 U39#2.13(6C) U39#2.14(5C)
OUTPUT7: J11#3.8 U39#2.15(4C) U39#2.16(3C)
OUTPUT8: J11#3.9 U39#2.17(2C) U39#2.18(1C)
OUTPUT9: J10#3.1 U44.11(8C) U44.12(7C)
OUTPUT10: J10#3.2 U44.13(6C) U44.14(5C)
OUTPUT11: J10#3.3 U44.15(4C) U44.16(3C)
OUTPUT12: J10#3.4 U44.17(2C) U44.18(1C)
OUTPUT13: J10#3.5 U49.11(8C) U49.12(7C)
OUTPUT14: J10#3.6 U49.13(6C) U49.14(5C)
OUTPUT15: J10#3.7 U49.15(4C) U49.16(3C)
OUTPUT16: J10#3.8 U49.17(2C) U49.18(1C)
NetLED10#3_A: LED10#3.A R30#3.2
NetLED11#3_A: LED11#3.A R31#3.2
NetLED12#3_A: LED12#3.A R32#3.2
NetLED13#3_A: LED13#3.A R33#3.2
NetLED14#3_A: LED14#3.A R34#3.2
NetLED15#3_A: LED15#3.A R35#3.2
NetLED16#3_A: LED16#3.A R36#3.2
NetLED17#3_A: LED17#3.A R37#3.2
NetLED30#3_A: LED30#3.A R21#4.2
NetLED31#3_A: LED31#3.A R22#3.2
NetLED32#3_A: LED32#3.A R23#3.2
NetLED33#3_A: LED33#3.A R24#3.2
NetLED34#3_A: LED34#3.A R25#3.2
NetLED35#3_A: LED35#3.A R26#3.2
NetLED36#3_A: LED36#3.A R27#3.2
NetLED37#3_A: LED37#3.A R28#3.2
NetR21#4_1: R21#4.1 U30#2.3(EMIT) U34#2.7(7B) U34#2.8(8B)
NetR22#3_1: R22#3.1 U31#2.3(EMIT) U34#2.5(5B) U34#2.6(6B)
NetR23#3_1: R23#3.1 U32#2.3(EMIT) U34#2.3(3B) U34#2.4(4B)
NetR24#3_1: R24#3.1 U33#2.3(EMIT) U34#2.1(1B) U34#2.2(2B)
NetR25#3_1: R25#3.1 U35#2.3(EMIT) U39#2.7(7B) U39#2.8(8B)
NetR26#3_1: R26#3.1 U36#2.3(EMIT) U39#2.5(5B) U39#2.6(6B)
NetR27#3_1: R27#3.1 U37#2.3(EMIT) U39#2.3(3B) U39#2.4(4B)
NetR28#3_1: R28#3.1 U38#2.3(EMIT) U39#2.1(1B) U39#2.2(2B)
NetR30#3_1: R30#3.1 U40.3(EMIT) U44.7(7B) U44.8(8B)
NetR31#3_1: R31#3.1 U41.3(EMIT) U44.5(5B) U44.6(6B)
NetR32#3_1: R32#3.1 U42.3(EMIT) U44.3(3B) U44.4(4B)
NetR33#3_1: R33#3.1 U43.3(EMIT) U44.1(1B) U44.2(2B)
NetR34#3_1: R34#3.1 U45.3(EMIT) U49.7(7B) U49.8(8B)
NetR35#3_1: R35#3.1 U46.3(EMIT) U49.5(5B) U49.6(6B)
NetR36#3_1: R36#3.1 U47.3(EMIT) U49.3(3B) U49.4(4B)
NetR37#3_1: R37#3.1 U48.3(EMIT) U49.1(1B) U49.2(2B)
NetR70#2_2: R70#2.2 U30#2.2(CATH)
NetR71#2_2: R71#2.2 U31#2.2(CATH)
NetR72#2_2: R72#2.2 U32#2.2(CATH)
NetR73#2_2: R73#2.2 U33#2.2(CATH)
NetR74#2_2: R74#2.2 U35#2.2(CATH)
NetR75#2_2: R75#2.2 U36#2.2(CATH)
NetR76#2_2: R76#2.2 U37#2.2(CATH)
NetR77#2_2: R77#2.2 U38#2.2(CATH)
NetR80#1_2: R80#1.2 U40.2(CATH)
NetR81_2: R81.2 U41.2(CATH)
NetR82_2: R82.2 U42.2(CATH)
NetR83_2: R83.2 U43.2(CATH)
NetR84_2: R84.2 U45.2(CATH)
NetR85_2: R85.2 U46.2(CATH)
NetR86_2: R86.2 U47.2(CATH)
NetR87_2: R87.2 U48.2(CATH)
NetR89#2_1: R89#2.1 U30#2.4(COL) U31#2.4(COL) U32#2.4(COL) U33#2.4(COL) U35#2.4(COL) U36#2.4(COL) U37#2.4(COL) U38#2.4(COL)
NetR99_1: R99.1 U40.4(COL) U41.4(COL) U42.4(COL) U43.4(COL) U45.4(COL) U46.4(COL) U47.4(COL) U48.4(COL)

### Library data of the parts
R21#4 R22#3 R23#3 R24#3 R25#3 R26#3 R27#3 R28#3 R30#3 R31#3 R32#3 R33#3 R34#3 R35#3 R36#3 R37#3 R70#2 R71#2 R72#2 R73#2 R74#2 R75#2 R76#2 R77#2 R80#1 R81-R87 R89#2 R99 = Res2: Resistor; Value: 1K; Published: 8-Jun-2000; LatestRevisionDate: 17-Jul-2002; LatestRevisionNote: Re-released for DXP Platform.; PackageReference: AXIAL-0.4; Publisher: Altium Limited
U30#2 U31#2 U32#2 U33#2 U35#2 U36#2 U37#2 U38#2 U40-U43 U45-U48 = TLP521-1: Single NPN PhotoTransistor OptoCoupler.